# EAGLE design Modular-Sensor-Breakout-Board4 (EAGLE 5.12)

## Sheet 1 of 8
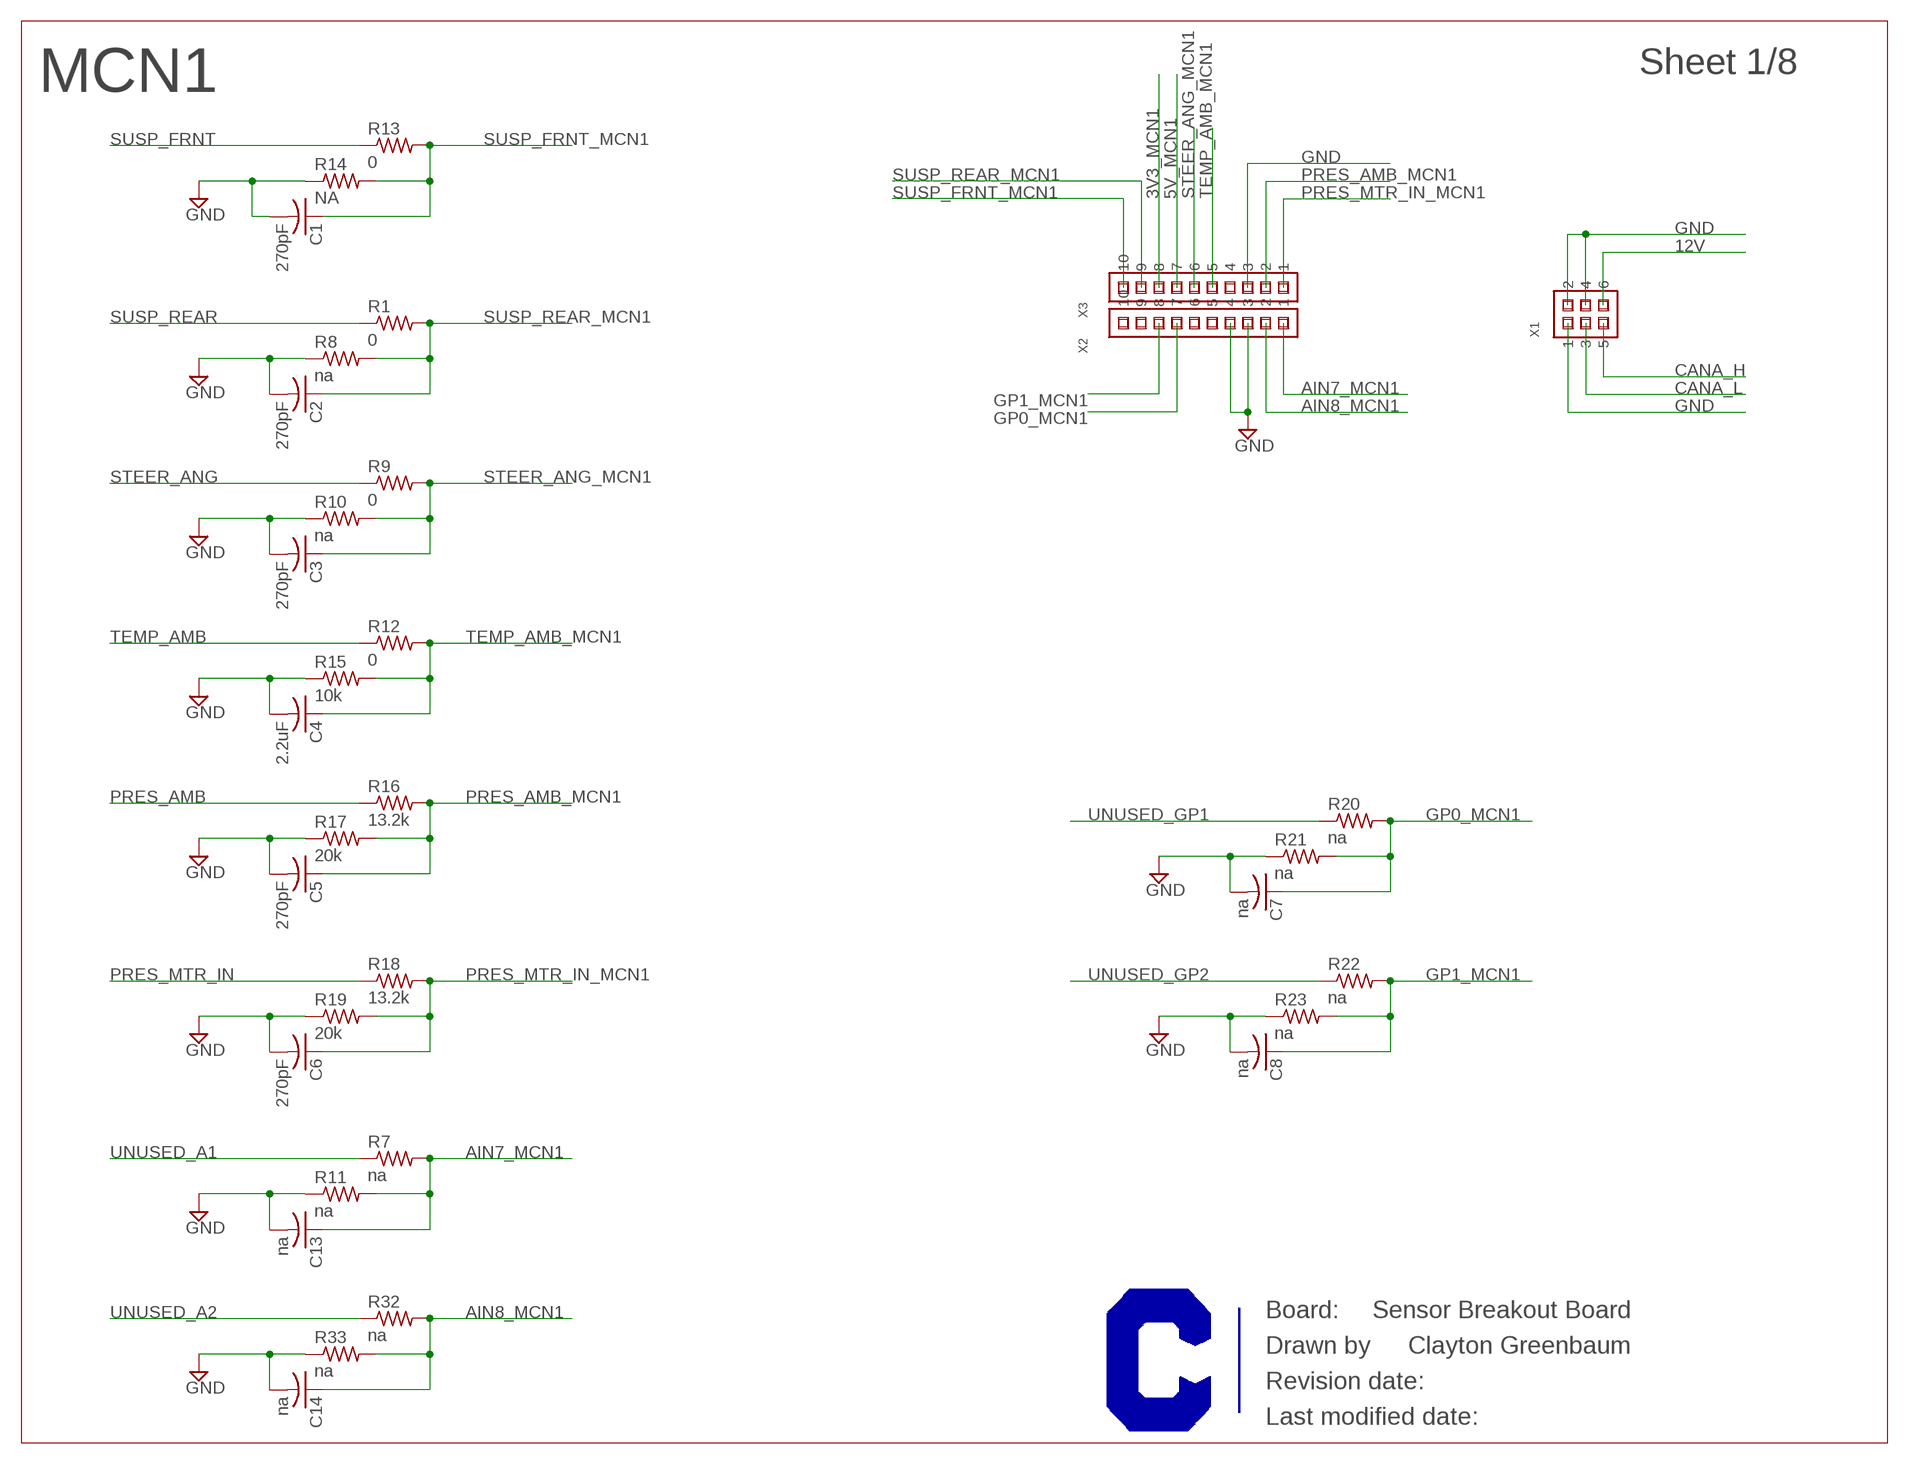
[diagram p0: schematic, sheet 1]

### Parts
C1  270pF  C-USC0603  [C0603]
C2  270pF  C-USC0603  [C0603]
C3  270pF  C-USC0603  [C0603]
C4  2.2uF  C-USC0603  [C0603]
C5  270pF  C-USC0603  [C0603]
C6  270pF  C-USC0603  [C0603]
C7  na  C-USC0603  [C0603]
C8  na  C-USC0603  [C0603]
C13  na  C-USC0603  [C0603]
C14  na  C-USC0603  [C0603]
R1  0  R-US_R0603  [R0603]
R7  na  R-US_R0603  [R0603]
R8  na  R-US_R0603  [R0603]
R9  0  R-US_R0603  [R0603]
R10  na  R-US_R0603  [R0603]
R11  na  R-US_R0603  [R0603]
R12  0  R-US_R0603  [R0603]
R13  0  R-US_R0603  [R0603]
R14  NA  R-US_R0603  [R0603]
R15  10k  R-US_R0603  [R0603]
R16  13.2k  R-US_R0603  [R0603]
R17  20k  R-US_R0603  [R0603]
R18  13.2k  R-US_R0603  [R0603]
R19  20k  R-US_R0603  [R0603]
R20  na  R-US_R0603  [R0603]
R21  na  R-US_R0603  [R0603]
R22  na  R-US_R0603  [R0603]
R23  na  R-US_R0603  [R0603]
R32  na  R-US_R0603  [R0603]
R33  na  R-US_R0603  [R0603]
X1  M22-71403XX  [M22-71403XX]
X2  M22-71310XX  [M22-71310XX]
X3  M22-71310XX  [M22-71310XX]

### Nets
3V3_MCN1 [Supply]: X3.8 ; also sheet 7
5V_MCN1 [Supply]: X3.7 ; also sheet 7
12V [Supply]: X1.6 ; also sheet 2,3,4,5,6,7,8
AIN7_MCN1: C13.1 R7.2 R11.2 X2.1
AIN8_MCN1: C14.1 R32.2 R33.2 X2.2
CANA_H: X1.5 ; also sheet 2,3,5,6,7
CANA_L: X1.3 ; also sheet 2,3,5,6,7
GND [Supply]: C1.2 C2.2 C3.2 C4.2 C5.2 C6.2 C7.2 C8.2 C13.2 C14.2 R8.1 R10.1 R11.1 R14.1 R15.1 R17.1 R19.1 R21.1 R23.1 R33.1 X1.1 X1.2 X1.4 X2.3 X2.4 X3.3 ; also sheet 2,3,4,5,6,7,8
GP0_MCN1: C7.1 R20.2 R21.2 X2.7
GP1_MCN1: C8.1 R22.2 R23.2 X2.8
PRES_AMB: R16.1 ; also sheet 7
PRES_AMB_MCN1: C5.1 R16.2 R17.2 X3.2
PRES_MTR_IN: R18.1 ; also sheet 7
PRES_MTR_IN_MCN1: C6.1 R18.2 R19.2 X3.1
STEER_ANG: R9.1 ; also sheet 7
STEER_ANG_MCN1: C3.1 R9.2 R10.2 X3.6
SUSP_FRNT: R13.1 ; also sheet 7
SUSP_FRNT_MCN1: C1.1 R13.2 R14.2 X3.10
SUSP_REAR: R1.1 ; also sheet 7
SUSP_REAR_MCN1: C2.1 R1.2 R8.2 X3.9
TEMP_AMB: R12.1 ; also sheet 7
TEMP_AMB_MCN1: C4.1 R12.2 R15.2 X3.5
UNUSED_A1: R7.1 ; also sheet 7
UNUSED_A2: R32.1 ; also sheet 7
UNUSED_GP1: R20.1 ; also sheet 7
UNUSED_GP2: R22.1 ; also sheet 7
Unconnected: X2.5 X2.6 X2.9 X2.10 X3.4

### Notes on the sheet
- MCN1
- Sensor Breakout Board
- Clayton Greenbaum

## Sheet 2 of 8
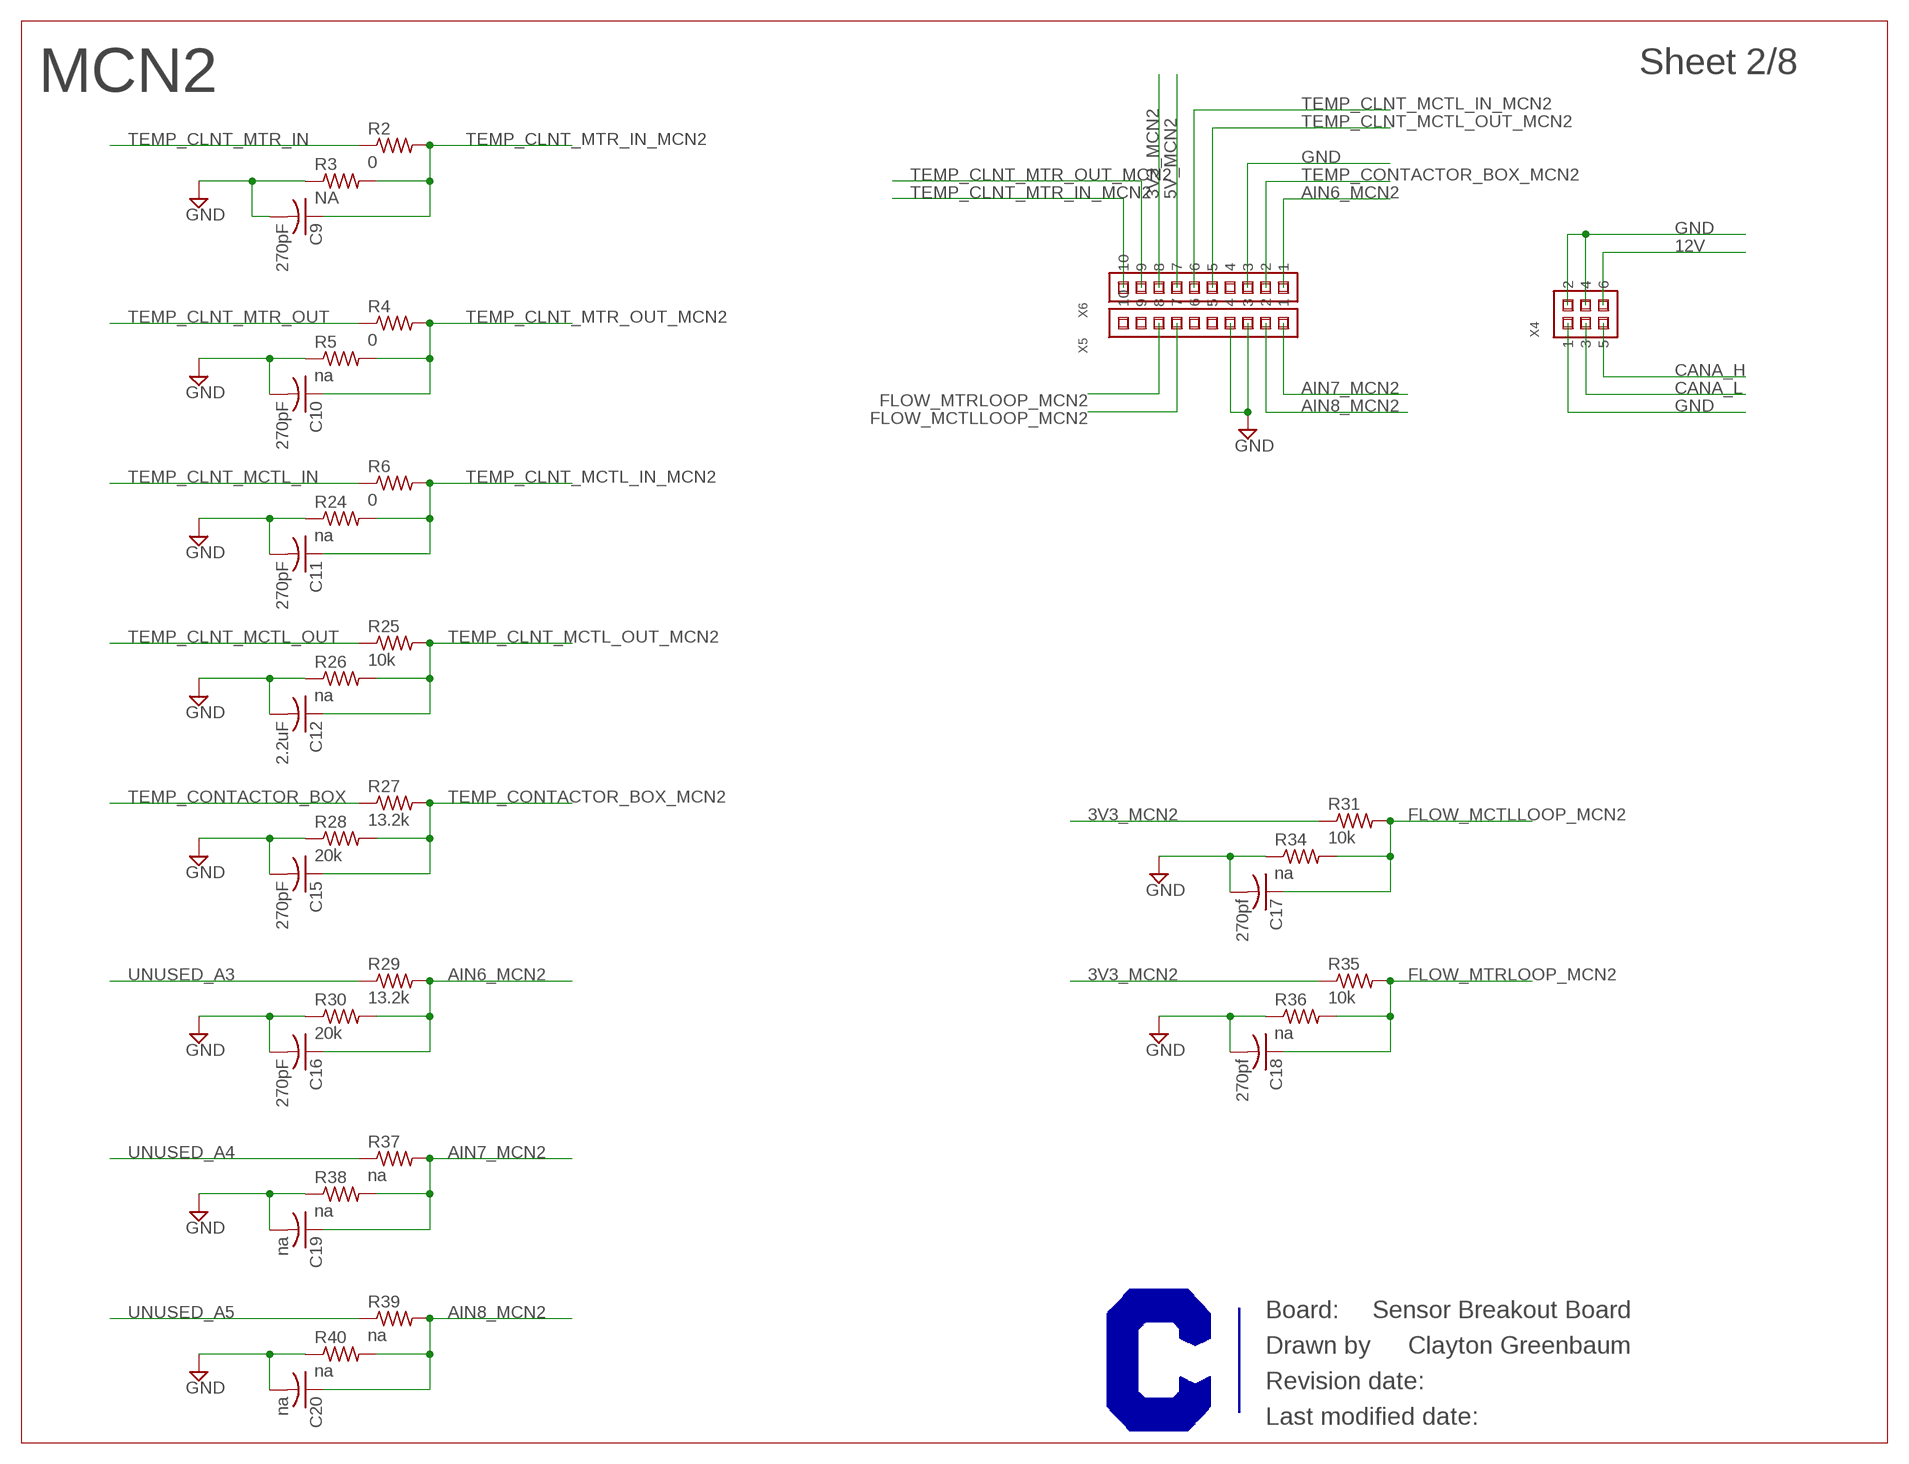
[diagram p1: schematic, sheet 2]

### Parts
C9  270pF  C-USC0603  [C0603]
C10  270pF  C-USC0603  [C0603]
C11  270pF  C-USC0603  [C0603]
C12  2.2uF  C-USC0603  [C0603]
C15  270pF  C-USC0603  [C0603]
C16  270pF  C-USC0603  [C0603]
C17  270pf  C-USC0603  [C0603]
C18  270pf  C-USC0603  [C0603]
C19  na  C-USC0603  [C0603]
C20  na  C-USC0603  [C0603]
R2  0  R-US_R0603  [R0603]
R3  NA  R-US_R0603  [R0603]
R4  0  R-US_R0603  [R0603]
R5  na  R-US_R0603  [R0603]
R6  0  R-US_R0603  [R0603]
R24  na  R-US_R0603  [R0603]
R25  10k  R-US_R0603  [R0603]
R26  na  R-US_R0603  [R0603]
R27  13.2k  R-US_R0603  [R0603]
R28  20k  R-US_R0603  [R0603]
R29  13.2k  R-US_R0603  [R0603]
R30  20k  R-US_R0603  [R0603]
R31  10k  R-US_R0603  [R0603]
R34  na  R-US_R0603  [R0603]
R35  10k  R-US_R0603  [R0603]
R36  na  R-US_R0603  [R0603]
R37  na  R-US_R0603  [R0603]
R38  na  R-US_R0603  [R0603]
R39  na  R-US_R0603  [R0603]
R40  na  R-US_R0603  [R0603]
X4  M22-71403XX  [M22-71403XX]
X5  M22-71310XX  [M22-71310XX]
X6  M22-71310XX  [M22-71310XX]

### Nets
3V3_MCN2 [Supply]: R31.1 R35.1 X6.8 ; also sheet 7
5V_MCN2 [Supply]: X6.7 ; also sheet 7
12V [Supply]: X4.6 ; also sheet 1,3,4,5,6,7,8
AIN6_MCN2: C16.1 R29.2 R30.2 X6.1
AIN7_MCN2: C19.1 R37.2 R38.2 X5.1
AIN8_MCN2: C20.1 R39.2 R40.2 X5.2
CANA_H: X4.5 ; also sheet 1,3,5,6,7
CANA_L: X4.3 ; also sheet 1,3,5,6,7
FLOW_MCTLLOOP_MCN2: C17.1 R31.2 R34.2 X5.7 ; also sheet 7
FLOW_MTRLOOP_MCN2: C18.1 R35.2 R36.2 X5.8 ; also sheet 7
GND [Supply]: C9.2 C10.2 C11.2 C12.2 C15.2 C16.2 C17.2 C18.2 C19.2 C20.2 R3.1 R5.1 R24.1 R26.1 R28.1 R30.1 R34.1 R36.1 R38.1 R40.1 X4.1 X4.2 X4.4 X5.3 X5.4 X6.3 ; also sheet 1,3,4,5,6,7,8
TEMP_CLNT_MCTL_IN: R6.1 ; also sheet 7
TEMP_CLNT_MCTL_IN_MCN2: C11.1 R6.2 R24.2 X6.6
TEMP_CLNT_MCTL_OUT: R25.1 ; also sheet 7
TEMP_CLNT_MCTL_OUT_MCN2: C12.1 R25.2 R26.2 X6.5
TEMP_CLNT_MTR_IN: R2.1 ; also sheet 7
TEMP_CLNT_MTR_IN_MCN2: C9.1 R2.2 R3.2 X6.10
TEMP_CLNT_MTR_OUT: R4.1 ; also sheet 7
TEMP_CLNT_MTR_OUT_MCN2: C10.1 R4.2 R5.2 X6.9
TEMP_CONTACTOR_BOX: R27.1 ; also sheet 7
TEMP_CONTACTOR_BOX_MCN2: C15.1 R27.2 R28.2 X6.2
UNUSED_A3: R29.1 ; also sheet 7
UNUSED_A4: R37.1 ; also sheet 7
UNUSED_A5: R39.1 ; also sheet 7
Unconnected: X5.5 X5.6 X5.9 X5.10 X6.4

### Notes on the sheet
- MCN2
- Sensor Breakout Board
- Clayton Greenbaum

## Sheet 3 of 8
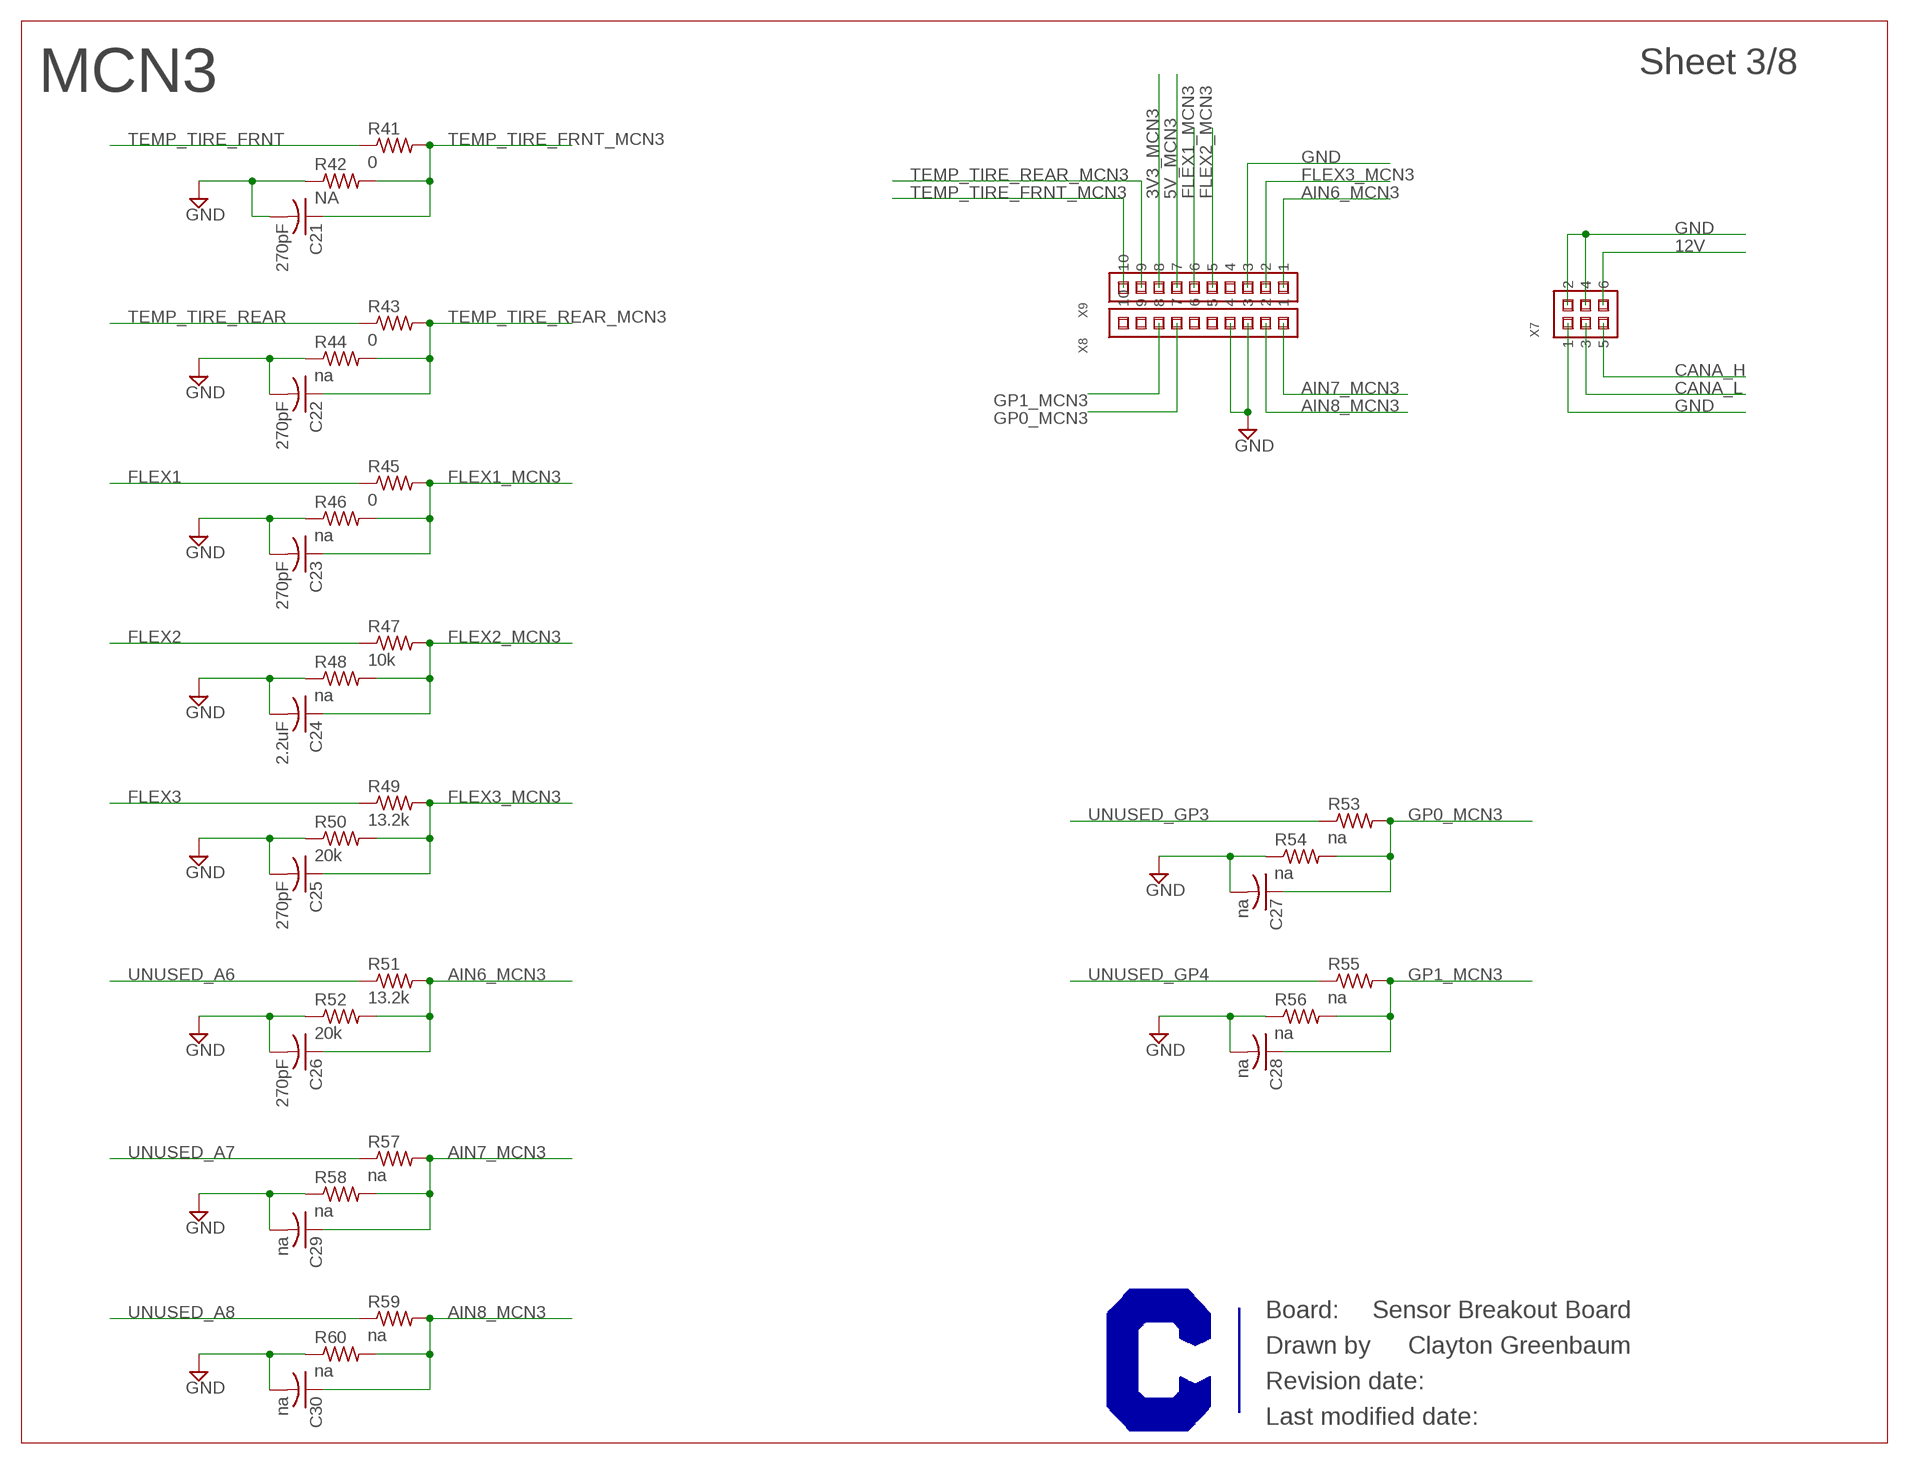
[diagram p2: schematic, sheet 3]

### Parts
C21  270pF  C-USC0603  [C0603]
C22  270pF  C-USC0603  [C0603]
C23  270pF  C-USC0603  [C0603]
C24  2.2uF  C-USC0603  [C0603]
C25  270pF  C-USC0603  [C0603]
C26  270pF  C-USC0603  [C0603]
C27  na  C-USC0603  [C0603]
C28  na  C-USC0603  [C0603]
C29  na  C-USC0603  [C0603]
C30  na  C-USC0603  [C0603]
R41  0  R-US_R0603  [R0603]
R42  NA  R-US_R0603  [R0603]
R43  0  R-US_R0603  [R0603]
R44  na  R-US_R0603  [R0603]
R45  0  R-US_R0603  [R0603]
R46  na  R-US_R0603  [R0603]
R47  10k  R-US_R0603  [R0603]
R48  na  R-US_R0603  [R0603]
R49  13.2k  R-US_R0603  [R0603]
R50  20k  R-US_R0603  [R0603]
R51  13.2k  R-US_R0603  [R0603]
R52  20k  R-US_R0603  [R0603]
R53  na  R-US_R0603  [R0603]
R54  na  R-US_R0603  [R0603]
R55  na  R-US_R0603  [R0603]
R56  na  R-US_R0603  [R0603]
R57  na  R-US_R0603  [R0603]
R58  na  R-US_R0603  [R0603]
R59  na  R-US_R0603  [R0603]
R60  na  R-US_R0603  [R0603]
X7  M22-71403XX  [M22-71403XX]
X8  M22-71310XX  [M22-71310XX]
X9  M22-71310XX  [M22-71310XX]

### Nets
3V3_MCN3 [Supply]: X9.8 ; also sheet 7
5V_MCN3 [Supply]: X9.7 ; also sheet 7
12V [Supply]: X7.6 ; also sheet 1,2,4,5,6,7,8
AIN6_MCN3: C26.1 R51.2 R52.2 X9.1
AIN7_MCN3: C29.1 R57.2 R58.2 X8.1
AIN8_MCN3: C30.1 R59.2 R60.2 X8.2
CANA_H: X7.5 ; also sheet 1,2,5,6,7
CANA_L: X7.3 ; also sheet 1,2,5,6,7
FLEX1: R45.1 ; also sheet 7
FLEX1_MCN3: C23.1 R45.2 R46.2 X9.6
FLEX2: R47.1 ; also sheet 7
FLEX2_MCN3: C24.1 R47.2 R48.2 X9.5
FLEX3: R49.1 ; also sheet 7
FLEX3_MCN3: C25.1 R49.2 R50.2 X9.2
GND [Supply]: C21.2 C22.2 C23.2 C24.2 C25.2 C26.2 C27.2 C28.2 C29.2 C30.2 R42.1 R44.1 R46.1 R48.1 R50.1 R52.1 R54.1 R56.1 R58.1 R60.1 X7.1 X7.2 X7.4 X8.3 X8.4 X9.3 ; also sheet 1,2,4,5,6,7,8
GP0_MCN3: C27.1 R53.2 R54.2 X8.7
GP1_MCN3: C28.1 R55.2 R56.2 X8.8
TEMP_TIRE_FRNT: R41.1 ; also sheet 7
TEMP_TIRE_FRNT_MCN3: C21.1 R41.2 R42.2 X9.10
TEMP_TIRE_REAR: R43.1 ; also sheet 7
TEMP_TIRE_REAR_MCN3: C22.1 R43.2 R44.2 X9.9
UNUSED_A6: R51.1 ; also sheet 7
UNUSED_A7: R57.1 ; also sheet 7
UNUSED_A8: R59.1 ; also sheet 7
UNUSED_GP3: R53.1 ; also sheet 7
UNUSED_GP4: R55.1 ; also sheet 7
Unconnected: X8.5 X8.6 X8.9 X8.10 X9.4

### Notes on the sheet
- MCN3
- Sensor Breakout Board
- Clayton Greenbaum

## Sheet 4 of 8
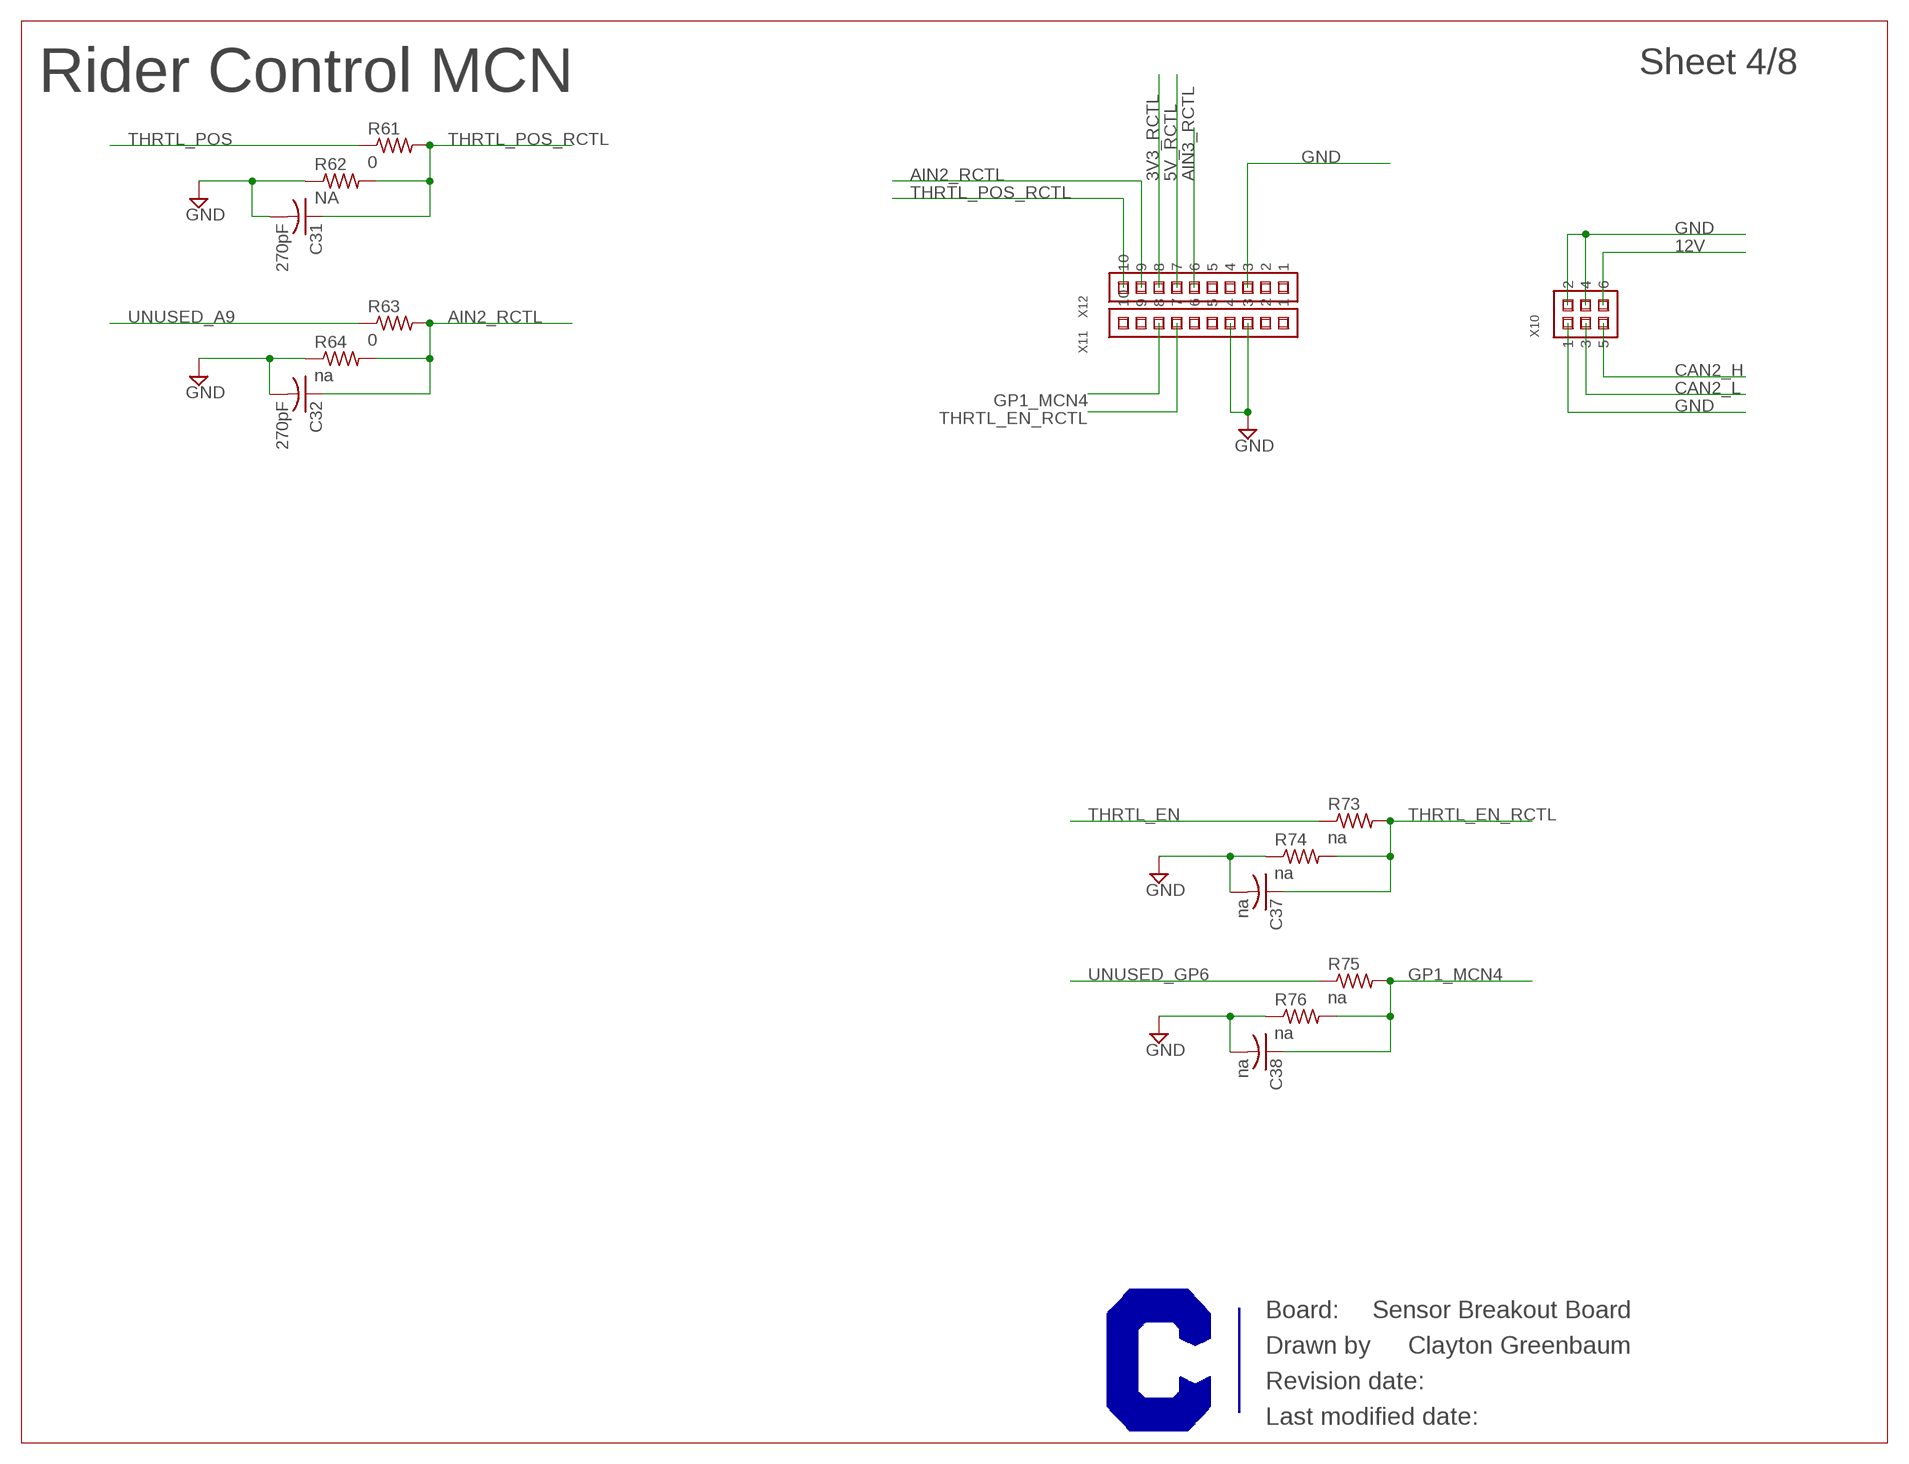
[diagram p3: schematic, sheet 4]

### Parts
C31  270pF  C-USC0603  [C0603]
C32  270pF  C-USC0603  [C0603]
C37  na  C-USC0603  [C0603]
C38  na  C-USC0603  [C0603]
R61  0  R-US_R0603  [R0603]
R62  NA  R-US_R0603  [R0603]
R63  0  R-US_R0603  [R0603]
R64  na  R-US_R0603  [R0603]
R73  na  R-US_R0603  [R0603]
R74  na  R-US_R0603  [R0603]
R75  na  R-US_R0603  [R0603]
R76  na  R-US_R0603  [R0603]
X10  M22-71403XX  [M22-71403XX]
X11  M22-71310XX  [M22-71310XX]
X12  M22-71310XX  [M22-71310XX]

### Nets
3V3_RCTL [Supply]: X12.8 ; also sheet 7
5V_RCTL [Supply]: X12.7 ; also sheet 7
12V [Supply]: X10.6 ; also sheet 1,2,3,5,6,7,8
AIN2_RCTL: C32.1 R63.2 R64.2 X12.9
AIN3_RCTL: X12.6
CAN2_H: X10.5 ; also sheet 6,7
CAN2_L: X10.3 ; also sheet 6,7
GND [Supply]: C31.2 C32.2 C37.2 C38.2 R62.1 R64.1 R74.1 R76.1 X10.1 X10.2 X10.4 X11.3 X11.4 X12.3 ; also sheet 1,2,3,5,6,7,8
GP1_MCN4: C38.1 R75.2 R76.2 X11.8
THRTL_EN: R73.1 ; also sheet 7
THRTL_EN_RCTL: C37.1 R73.2 R74.2 X11.7
THRTL_POS: R61.1 ; also sheet 7
THRTL_POS_RCTL: C31.1 R61.2 R62.2 X12.10
UNUSED_A9: R63.1 ; also sheet 7
UNUSED_GP6: R75.1 ; also sheet 7
Unconnected: X11.1 X11.2 X11.5 X11.6 X11.9 X11.10 X12.1 X12.2 X12.4 X12.5

### Notes on the sheet
- Rider Control MCN
- Sensor Breakout Board
- Clayton Greenbaum

## Sheet 5 of 8
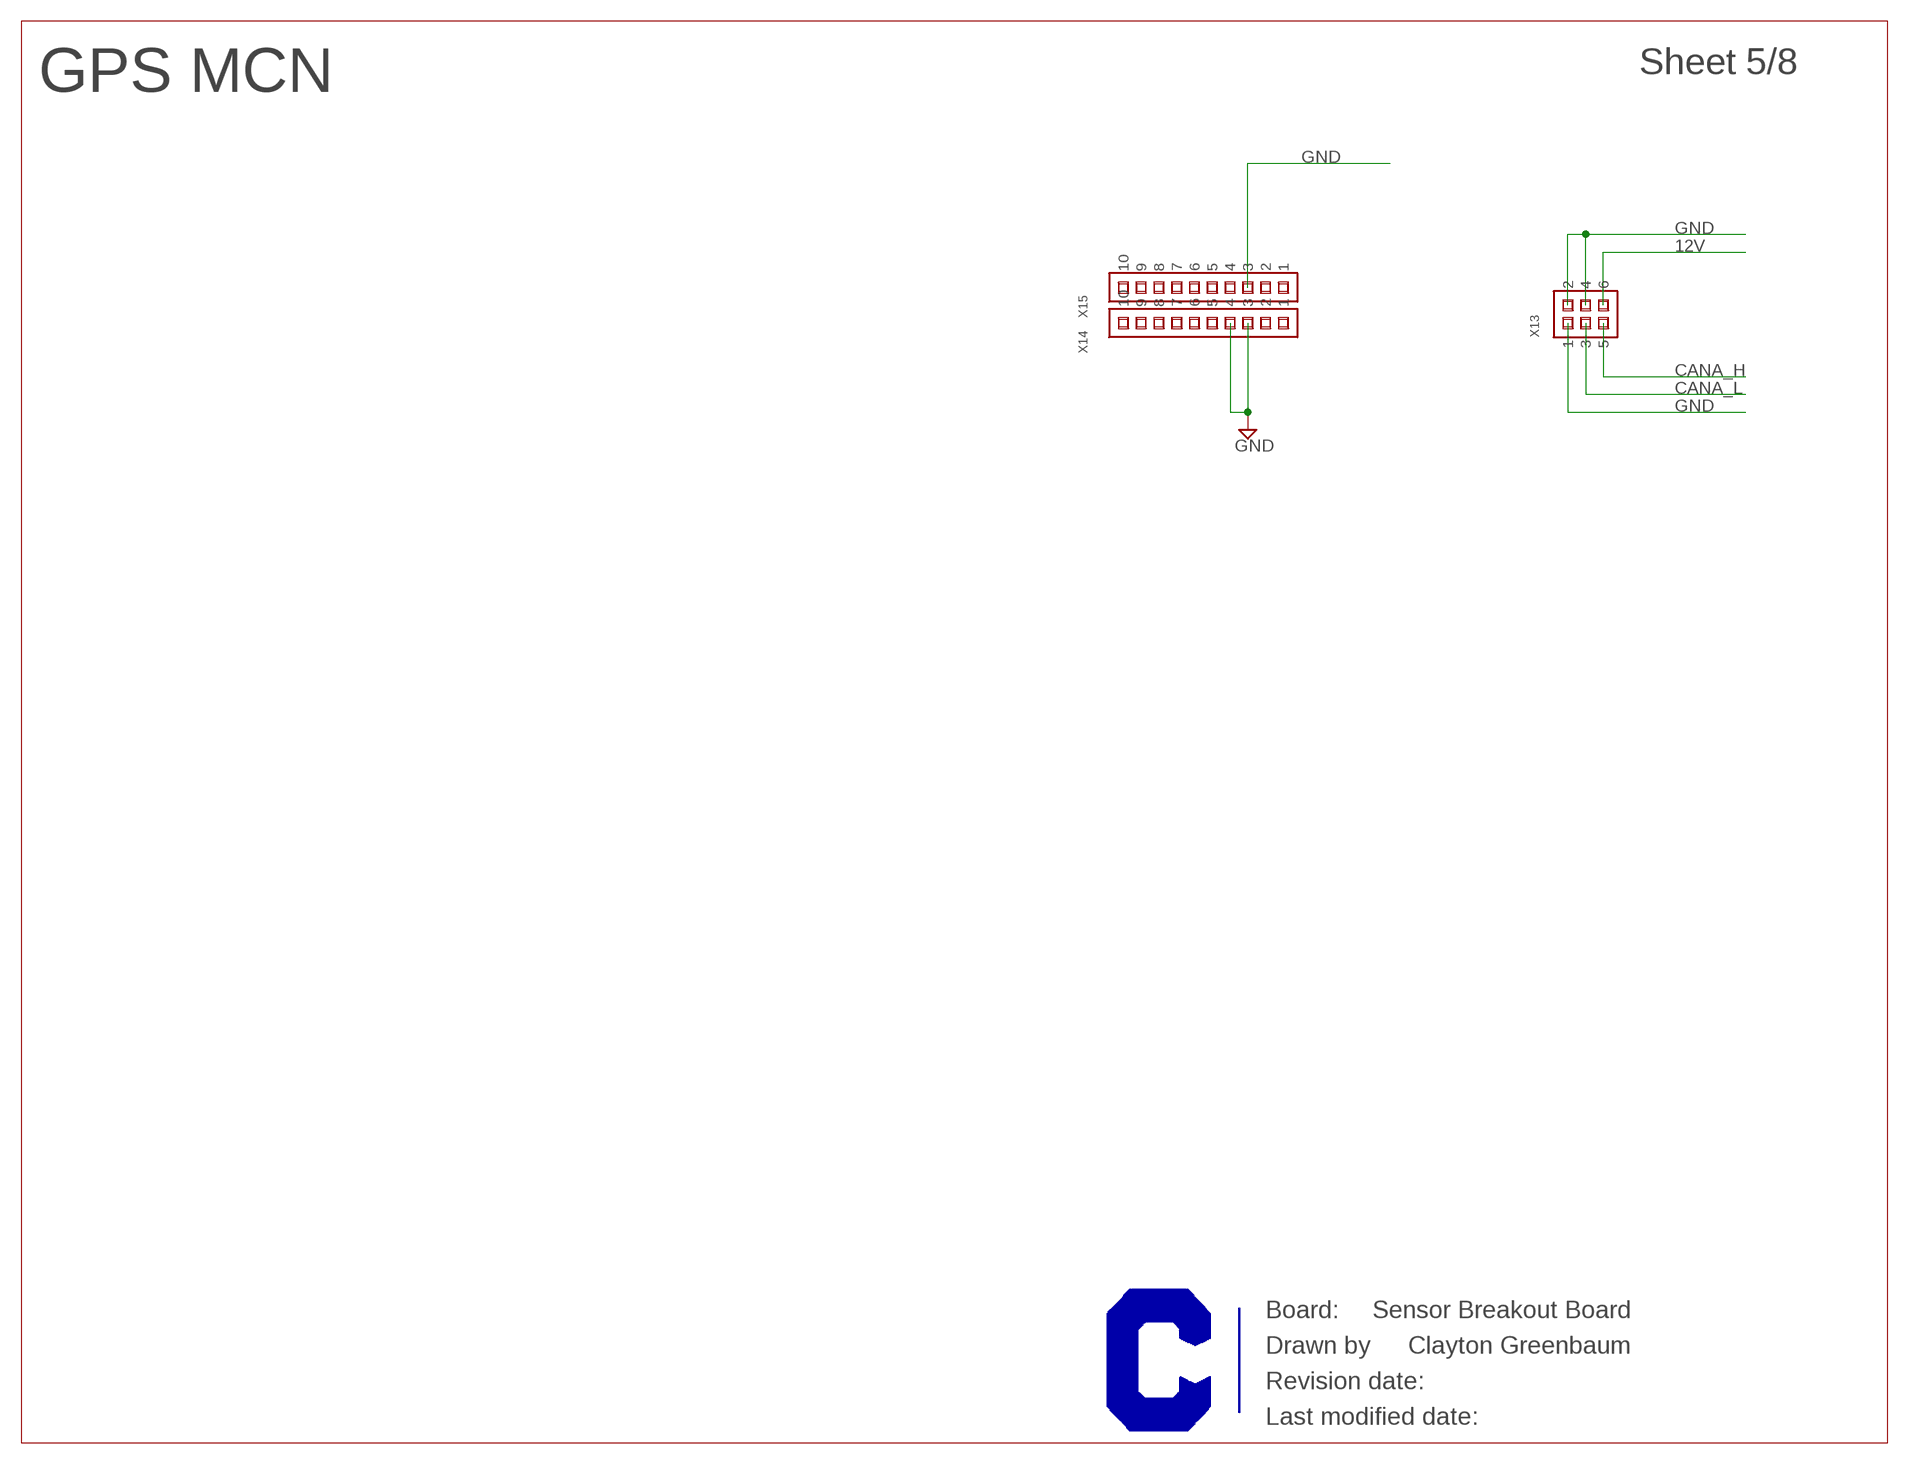
[diagram p4: schematic, sheet 5]

### Parts
X13  M22-71403XX  [M22-71403XX]
X14  M22-71310XX  [M22-71310XX]
X15  M22-71310XX  [M22-71310XX]

### Nets
12V [Supply]: X13.6 ; also sheet 1,2,3,4,6,7,8
CANA_H: X13.5 ; also sheet 1,2,3,6,7
CANA_L: X13.3 ; also sheet 1,2,3,6,7
GND [Supply]: X13.1 X13.2 X13.4 X14.3 X14.4 X15.3 ; also sheet 1,2,3,4,6,7,8
Unconnected: X14.1 X14.2 X14.5 X14.6 X14.7 X14.8 X14.9 X14.10 X15.1 X15.2 X15.4 X15.5 X15.6 X15.7 X15.8 X15.9 X15.10

### Notes on the sheet
- GPS MCN
- Sensor Breakout Board
- Clayton Greenbaum

## Sheet 6 of 8
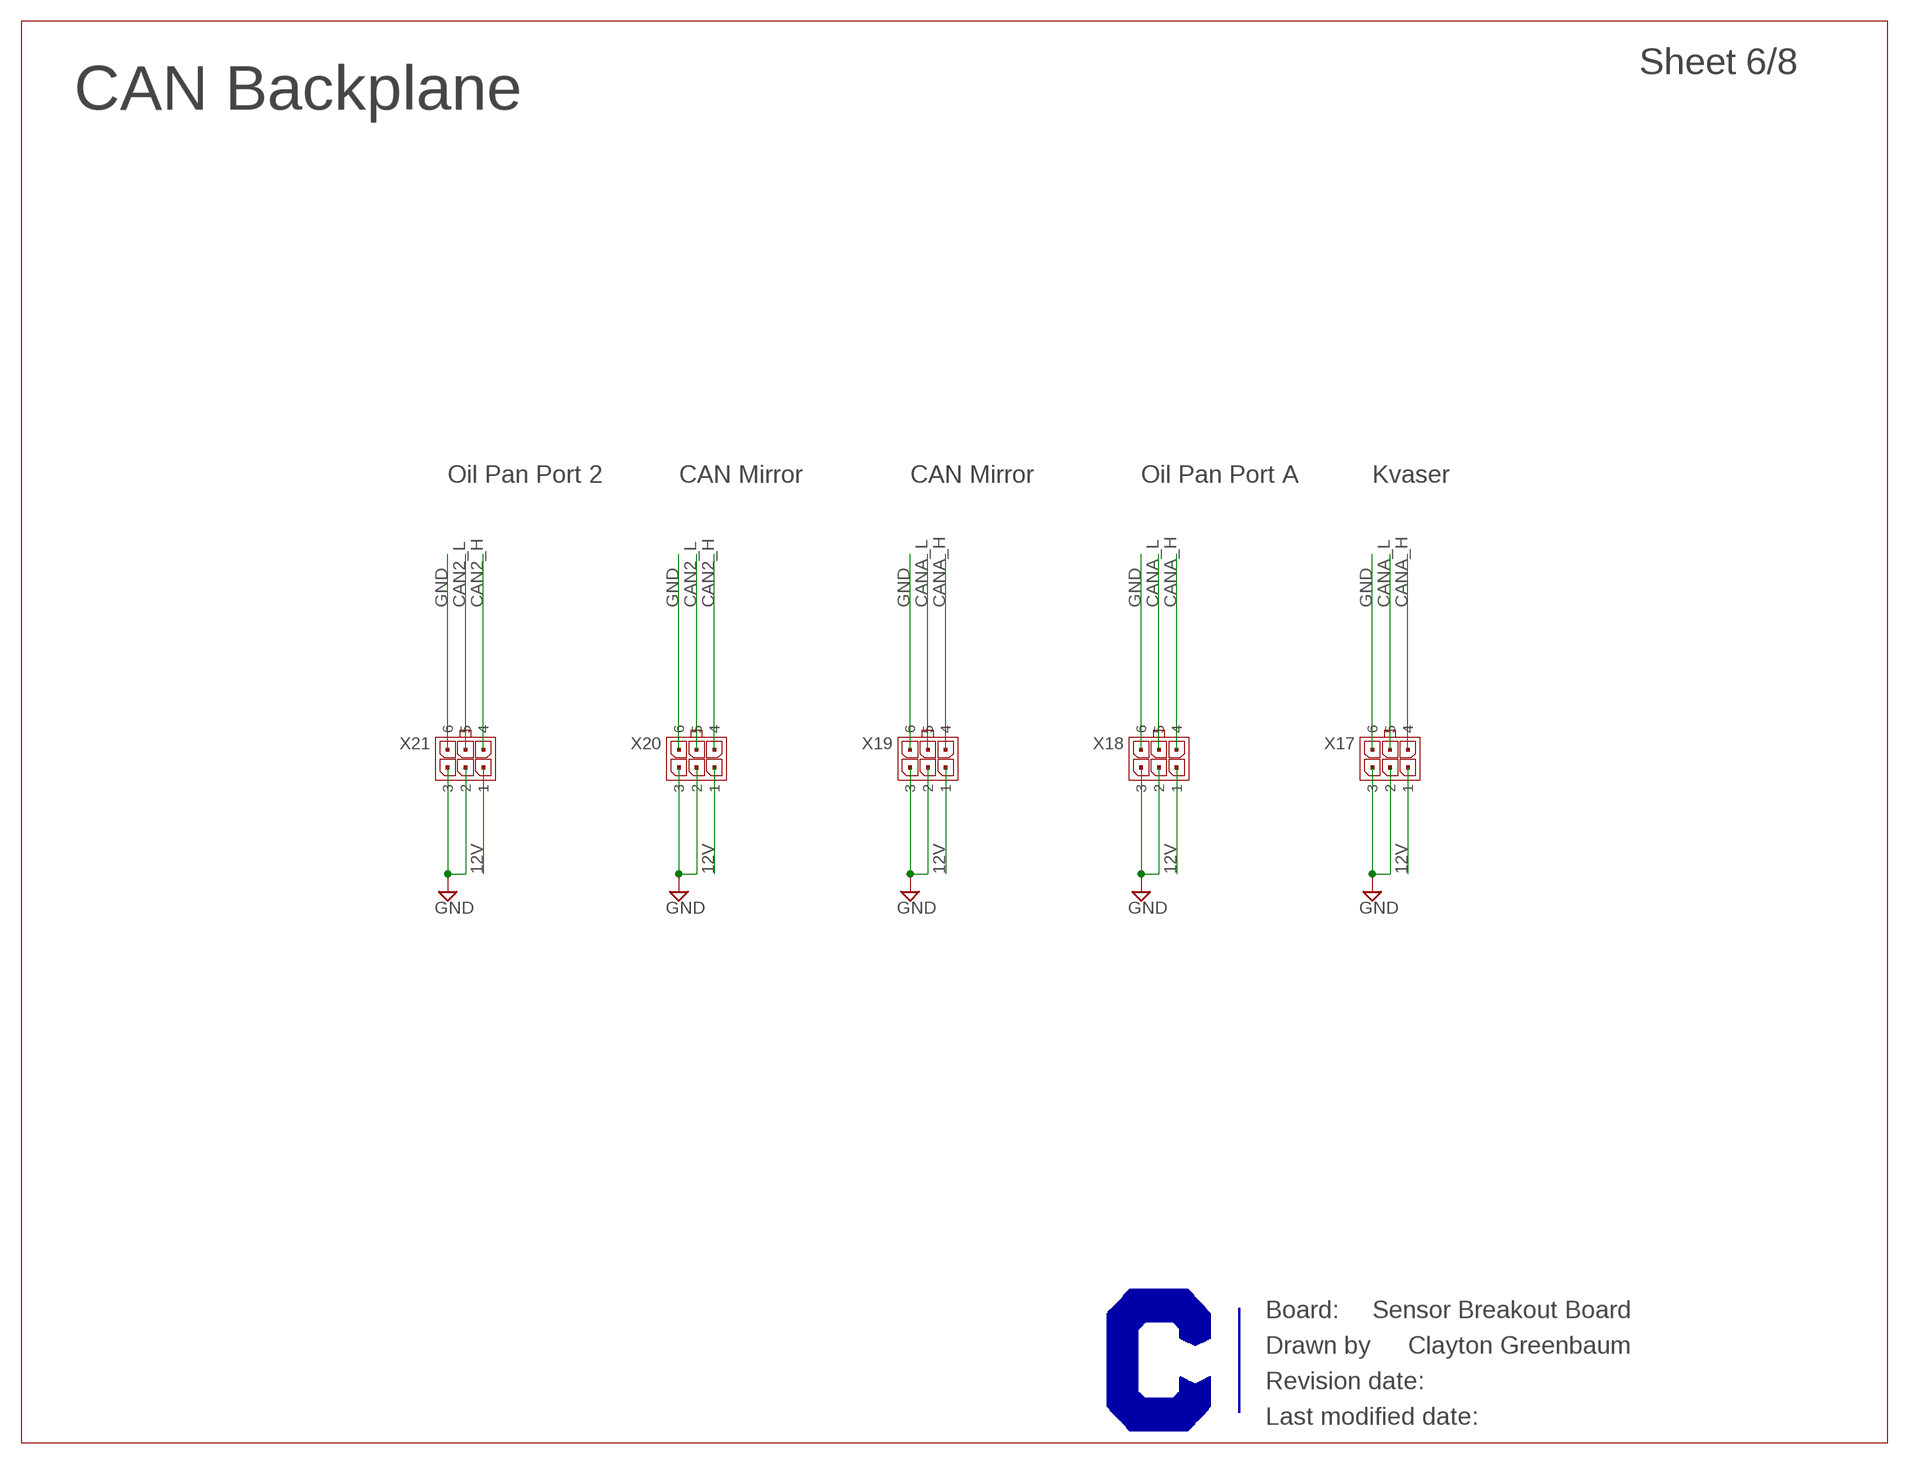
[diagram p5: schematic, sheet 6]

### Parts
X17  MICROFIT-06-DUAL-THROUGH_HOLE-PEG_RETENTION-GOLD  [MICROFIT-6-DUAL-RA-THROUGH_HOLE-PEG_RETENTION]
X18  MICROFIT-06-DUAL-THROUGH_HOLE-PEG_RETENTION-GOLD  [MICROFIT-6-DUAL-RA-THROUGH_HOLE-PEG_RETENTION]
X19  MICROFIT-06-DUAL-THROUGH_HOLE-PEG_RETENTION-GOLD  [MICROFIT-6-DUAL-RA-THROUGH_HOLE-PEG_RETENTION]
X20  MICROFIT-06-DUAL-THROUGH_HOLE-PEG_RETENTION-GOLD  [MICROFIT-6-DUAL-RA-THROUGH_HOLE-PEG_RETENTION]
X21  MICROFIT-06-DUAL-THROUGH_HOLE-PEG_RETENTION-GOLD  [MICROFIT-6-DUAL-RA-THROUGH_HOLE-PEG_RETENTION]

### Nets
12V [Supply]: X17.1 X18.1 X19.1 X20.1 X21.1 ; also sheet 1,2,3,4,5,7,8
CAN2_H: X20.4 X21.4 ; also sheet 4,7
CAN2_L: X20.5 X21.5 ; also sheet 4,7
CANA_H: X17.4 X18.4 X19.4 ; also sheet 1,2,3,5,7
CANA_L: X17.5 X18.5 X19.5 ; also sheet 1,2,3,5,7
GND [Supply]: X17.2 X17.3 X17.6 X18.2 X18.3 X18.6 X19.2 X19.3 X19.6 X20.2 X20.3 X20.6 X21.2 X21.3 X21.6 ; also sheet 1,2,3,4,5,7,8

### Notes on the sheet
- CAN Backplane
- Oil Pan Port 2 | CAN Mirror | CAN Mirror | Oil Pan Port A | Kvaser
- Sensor Breakout Board
- Clayton Greenbaum

## Sheet 7 of 8
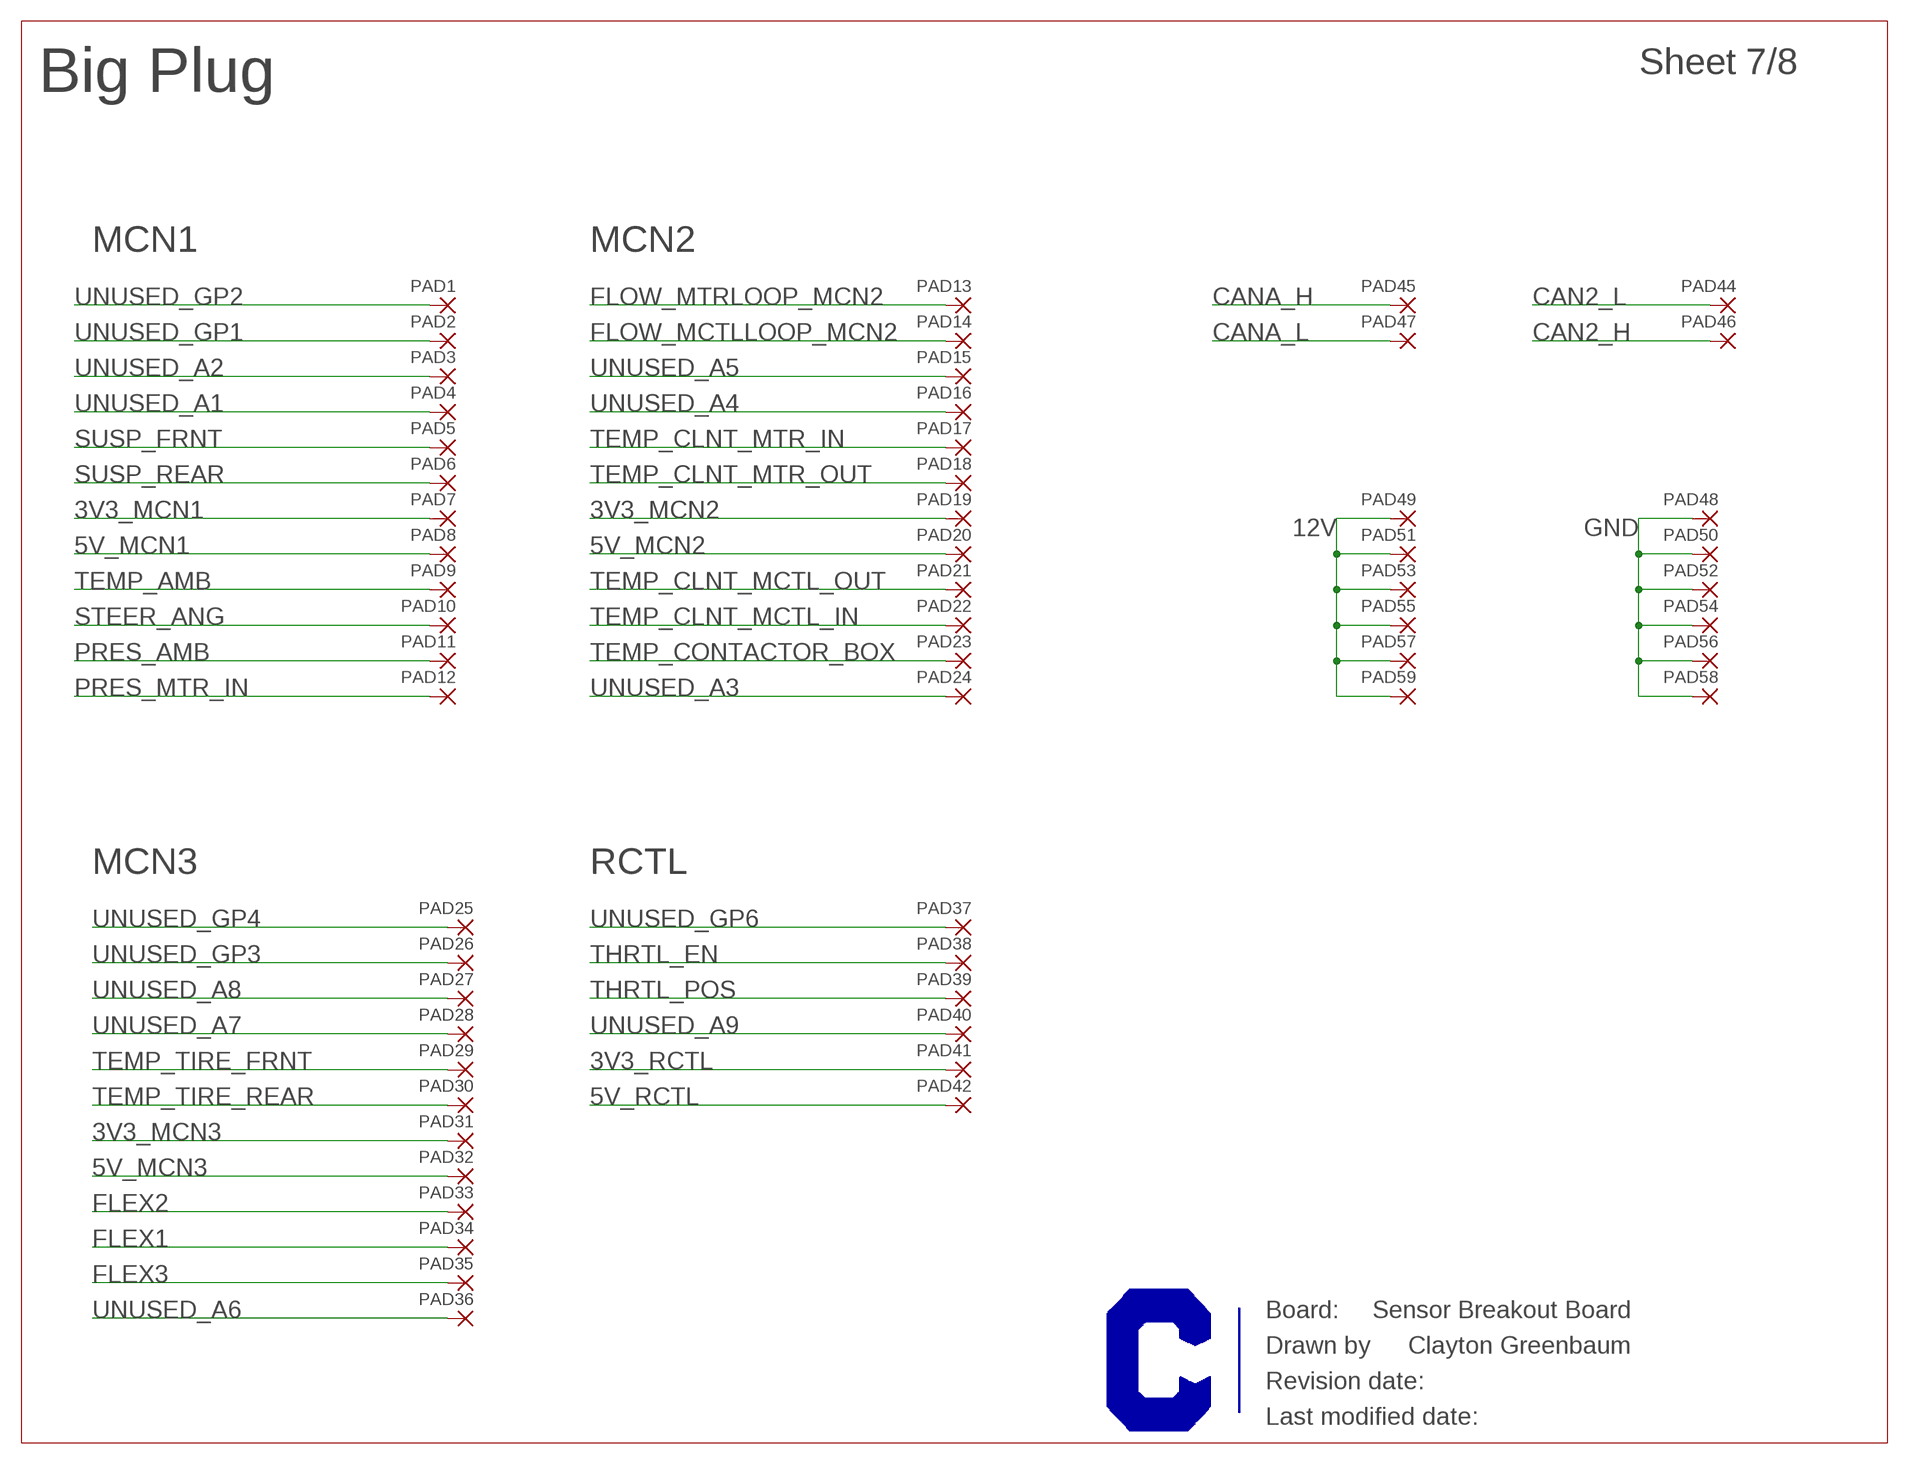
[diagram p6: schematic, sheet 7]

### Parts
PAD1  2,54/0,9  [2,54/0,9]
PAD2  2,54/0,9  [2,54/0,9]
PAD3  2,54/0,9  [2,54/0,9]
PAD4  2,54/0,9  [2,54/0,9]
PAD5  2,54/0,9  [2,54/0,9]
PAD6  2,54/0,9  [2,54/0,9]
PAD7  2,54/0,9  [2,54/0,9]
PAD8  2,54/0,9  [2,54/0,9]
PAD9  2,54/0,9  [2,54/0,9]
PAD10  2,54/0,9  [2,54/0,9]
PAD11  2,54/0,9  [2,54/0,9]
PAD12  2,54/0,9  [2,54/0,9]
PAD13  2,54/0,9  [2,54/0,9]
PAD14  2,54/0,9  [2,54/0,9]
PAD15  2,54/0,9  [2,54/0,9]
PAD16  2,54/0,9  [2,54/0,9]
PAD17  2,54/0,9  [2,54/0,9]
PAD18  2,54/0,9  [2,54/0,9]
PAD19  2,54/0,9  [2,54/0,9]
PAD20  2,54/0,9  [2,54/0,9]
PAD21  2,54/0,9  [2,54/0,9]
PAD22  2,54/0,9  [2,54/0,9]
PAD23  2,54/0,9  [2,54/0,9]
PAD24  2,54/0,9  [2,54/0,9]
PAD25  2,54/0,9  [2,54/0,9]
PAD26  2,54/0,9  [2,54/0,9]
PAD27  2,54/0,9  [2,54/0,9]
PAD28  2,54/0,9  [2,54/0,9]
PAD29  2,54/0,9  [2,54/0,9]
PAD30  2,54/0,9  [2,54/0,9]
PAD31  2,54/0,9  [2,54/0,9]
PAD32  2,54/0,9  [2,54/0,9]
PAD33  2,54/0,9  [2,54/0,9]
PAD34  2,54/0,9  [2,54/0,9]
PAD35  2,54/0,9  [2,54/0,9]
PAD36  2,54/0,9  [2,54/0,9]
PAD37  2,54/0,9  [2,54/0,9]
PAD38  2,54/0,9  [2,54/0,9]
PAD39  2,54/0,9  [2,54/0,9]
PAD40  2,54/0,9  [2,54/0,9]
PAD41  2,54/0,9  [2,54/0,9]
PAD42  2,54/0,9  [2,54/0,9]
PAD44  2,54/0,9  [2,54/0,9]
PAD45  2,54/0,9  [2,54/0,9]
PAD46  2,54/0,9  [2,54/0,9]
PAD47  2,54/0,9  [2,54/0,9]
PAD48  2,54/0,9  [2,54/0,9]
PAD49  2,54/0,9  [2,54/0,9]
PAD50  2,54/0,9  [2,54/0,9]
PAD51  2,54/0,9  [2,54/0,9]
PAD52  2,54/0,9  [2,54/0,9]
PAD53  2,54/0,9  [2,54/0,9]
PAD54  2,54/0,9  [2,54/0,9]
PAD55  2,54/0,9  [2,54/0,9]
PAD56  2,54/0,9  [2,54/0,9]
PAD57  2,54/0,9  [2,54/0,9]
PAD58  2,54/0,9  [2,54/0,9]
PAD59  2,54/0,9  [2,54/0,9]

### Nets
3V3_MCN1 [Supply]: PAD7.1(P) ; also sheet 1
3V3_MCN2 [Supply]: PAD19.1(P) ; also sheet 2
3V3_MCN3 [Supply]: PAD31.1(P) ; also sheet 3
3V3_RCTL [Supply]: PAD41.1(P) ; also sheet 4
5V_MCN1 [Supply]: PAD8.1(P) ; also sheet 1
5V_MCN2 [Supply]: PAD20.1(P) ; also sheet 2
5V_MCN3 [Supply]: PAD32.1(P) ; also sheet 3
5V_RCTL [Supply]: PAD42.1(P) ; also sheet 4
12V [Supply]: PAD49.1(P) PAD51.1(P) PAD53.1(P) PAD55.1(P) PAD57.1(P) PAD59.1(P) ; also sheet 1,2,3,4,5,6,8
CAN2_H: PAD46.1(P) ; also sheet 4,6
CAN2_L: PAD44.1(P) ; also sheet 4,6
CANA_H: PAD45.1(P) ; also sheet 1,2,3,5,6
CANA_L: PAD47.1(P) ; also sheet 1,2,3,5,6
FLEX1: PAD34.1(P) ; also sheet 3
FLEX2: PAD33.1(P) ; also sheet 3
FLEX3: PAD35.1(P) ; also sheet 3
FLOW_MCTLLOOP_MCN2: PAD14.1(P) ; also sheet 2
FLOW_MTRLOOP_MCN2: PAD13.1(P) ; also sheet 2
GND [Supply]: PAD48.1(P) PAD50.1(P) PAD52.1(P) PAD54.1(P) PAD56.1(P) PAD58.1(P) ; also sheet 1,2,3,4,5,6,8
PRES_AMB: PAD11.1(P) ; also sheet 1
PRES_MTR_IN: PAD12.1(P) ; also sheet 1
STEER_ANG: PAD10.1(P) ; also sheet 1
SUSP_FRNT: PAD5.1(P) ; also sheet 1
SUSP_REAR: PAD6.1(P) ; also sheet 1
TEMP_AMB: PAD9.1(P) ; also sheet 1
TEMP_CLNT_MCTL_IN: PAD22.1(P) ; also sheet 2
TEMP_CLNT_MCTL_OUT: PAD21.1(P) ; also sheet 2
TEMP_CLNT_MTR_IN: PAD17.1(P) ; also sheet 2
TEMP_CLNT_MTR_OUT: PAD18.1(P) ; also sheet 2
TEMP_CONTACTOR_BOX: PAD23.1(P) ; also sheet 2
TEMP_TIRE_FRNT: PAD29.1(P) ; also sheet 3
TEMP_TIRE_REAR: PAD30.1(P) ; also sheet 3
THRTL_EN: PAD38.1(P) ; also sheet 4
THRTL_POS: PAD39.1(P) ; also sheet 4
UNUSED_A1: PAD4.1(P) ; also sheet 1
UNUSED_A2: PAD3.1(P) ; also sheet 1
UNUSED_A3: PAD24.1(P) ; also sheet 2
UNUSED_A4: PAD16.1(P) ; also sheet 2
UNUSED_A5: PAD15.1(P) ; also sheet 2
UNUSED_A6: PAD36.1(P) ; also sheet 3
UNUSED_A7: PAD28.1(P) ; also sheet 3
UNUSED_A8: PAD27.1(P) ; also sheet 3
UNUSED_A9: PAD40.1(P) ; also sheet 4
UNUSED_GP1: PAD2.1(P) ; also sheet 1
UNUSED_GP2: PAD1.1(P) ; also sheet 1
UNUSED_GP3: PAD26.1(P) ; also sheet 3
UNUSED_GP4: PAD25.1(P) ; also sheet 3
UNUSED_GP6: PAD37.1(P) ; also sheet 4

### Notes on the sheet
- Big Plug
- MCN1 | MCN2
- MCN3 | RCTL
- Sensor Breakout Board
- Clayton Greenbaum

## Sheet 8 of 8
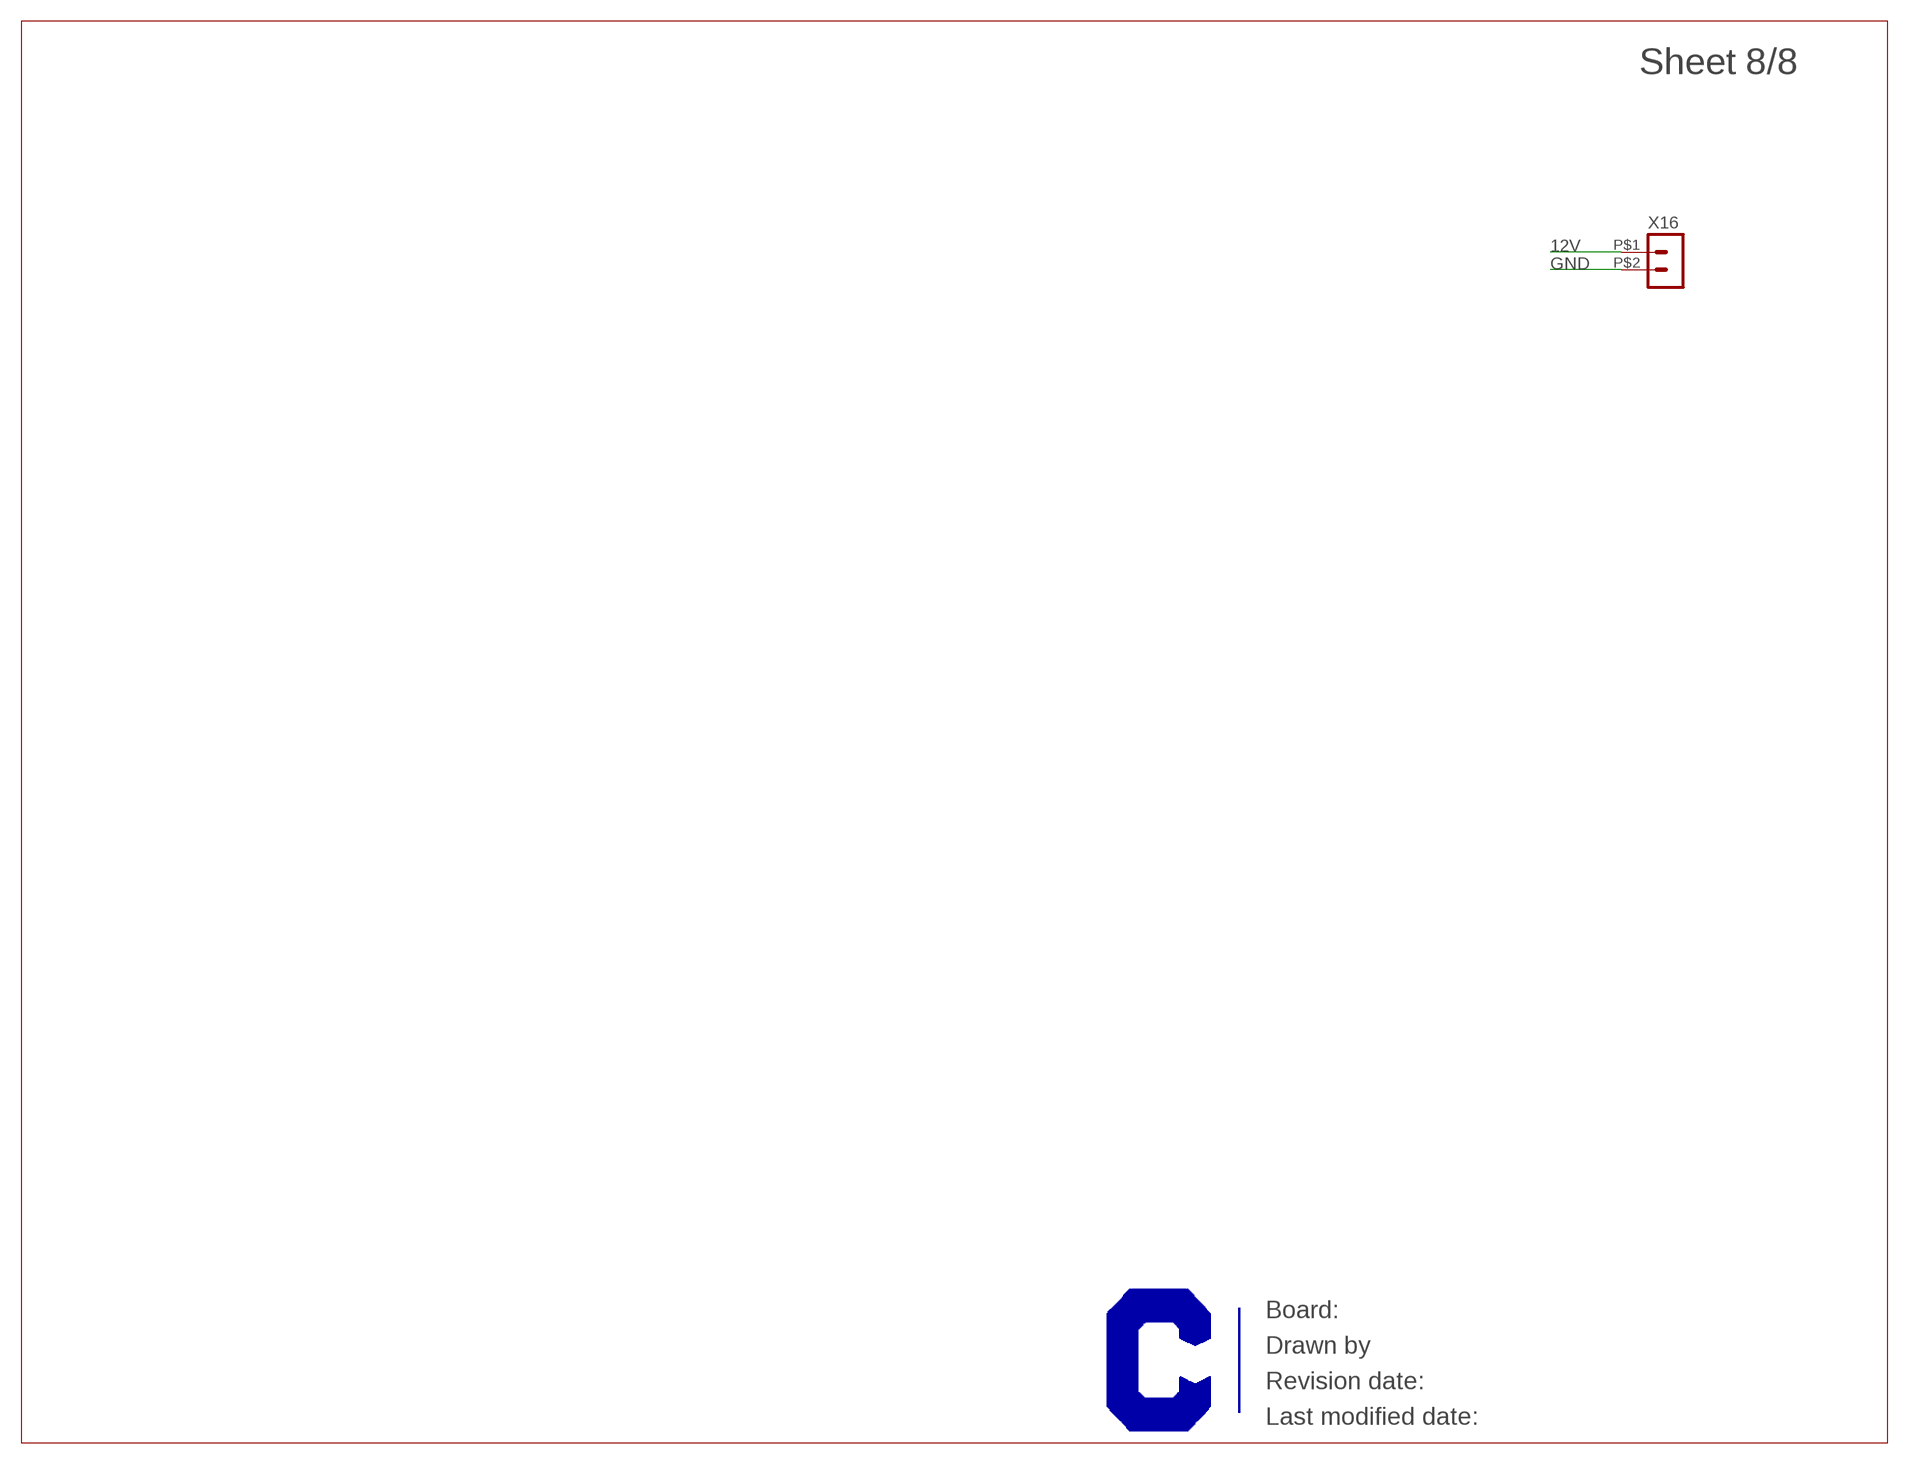
[diagram p7: schematic, sheet 8]

### Parts
X16  HEADER_POS2_43045-0200  [43045-0200]

### Nets
12V [Supply]: X16.P$1 ; also sheet 1,2,3,4,5,6,7
GND [Supply]: X16.P$2 ; also sheet 1,2,3,4,5,6,7

## Library data of the parts
C1-C32 C37 C38 = resistor:C-US: CAPACITOR, American symbol
PAD1-PAD42 PAD44-PAD59 = wirepad:2,54/0,9: THROUGH-HOLE PAD
R1-R64 R73-R76 = rcl:R-US_: RESISTOR, American symbol
X1 X4 X7 X10 X13 = Harwin:M22-71403XX: M22-71403XX - 2x3 pos female header assy, 2.0mm pitch Datasheet: https://cdn.harwin.com/pdfs/M22-714.pdf; PARTNO: M22-7140342
X2 X3 X5 X6 X8 X9 X11 X12 X14 X15 = Harwin:M22-71310XX: Harwin M22-71310XX - 10pos single row female pin hdr, 2mm pitch Datasheet: https://cdn.harwin.com/pdfs/M22-713.pdf; PARTNO: M22-7131042
X16 = con-molex-micro-fit-3_0:HEADER_POS2_?: Molex - Micro-Fit 3.0 Series connector, 3.00mm (0.118") pitch header, 2 positions.
X17-X21 = Molex:MICROFIT-06-DUAL: Molex MicroFit 3.00mm Pitch Header, Surface Mount, Dual Row, 6 Circuits Note, November 2014: These come in three styles: Through-hole, with metal clip retention to PCB (not currently represented) (cheapest) SMD, with solder tab retention (-SMD) (more expensive, commonly stocked) SMD, with metal clip retention (-SMD-CLIP_RETENTION) (most expensive, not often stocked) Please use them in that order! Drawing: http://www.molex.com/pdm_docs/sd/430450609_sd.pdf (right-angle) Information: http://www.molex.com/molex/products/datasheet.jsp?part=active/0430450618_PCB_HEADERS.xml; PARTNO: 43045-0601

## Net classes
1 Supply: width 0.508 mm

## Board
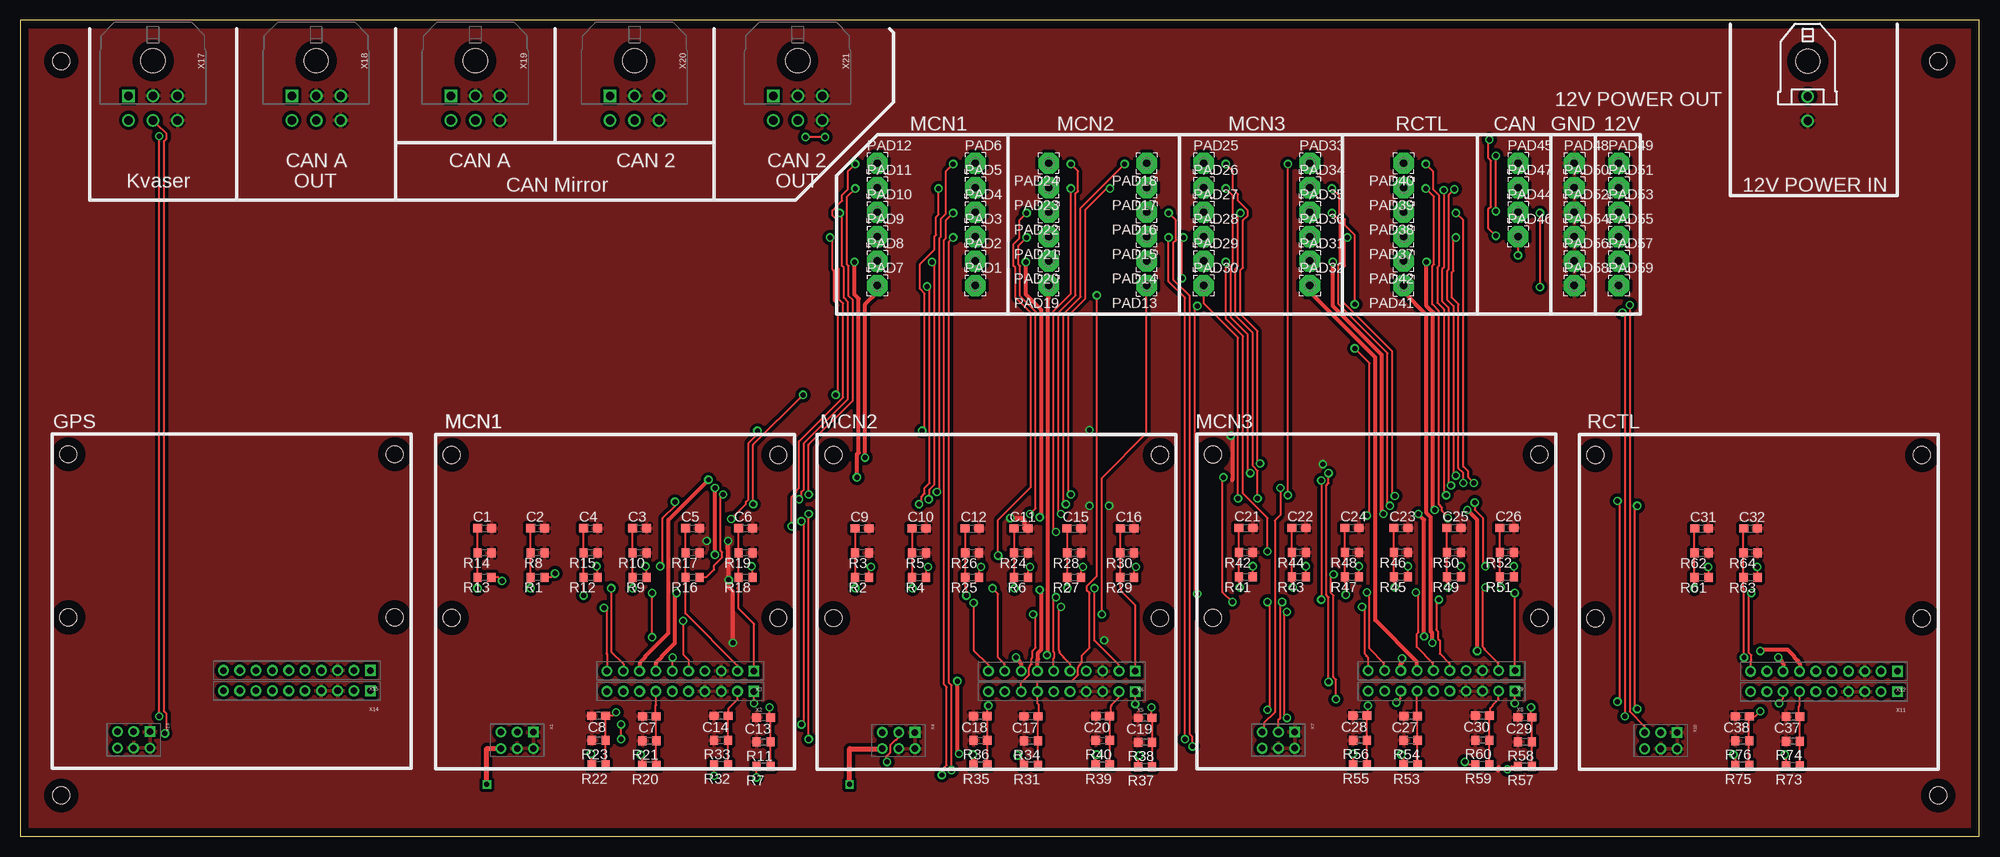
[diagram p8: board, top side]
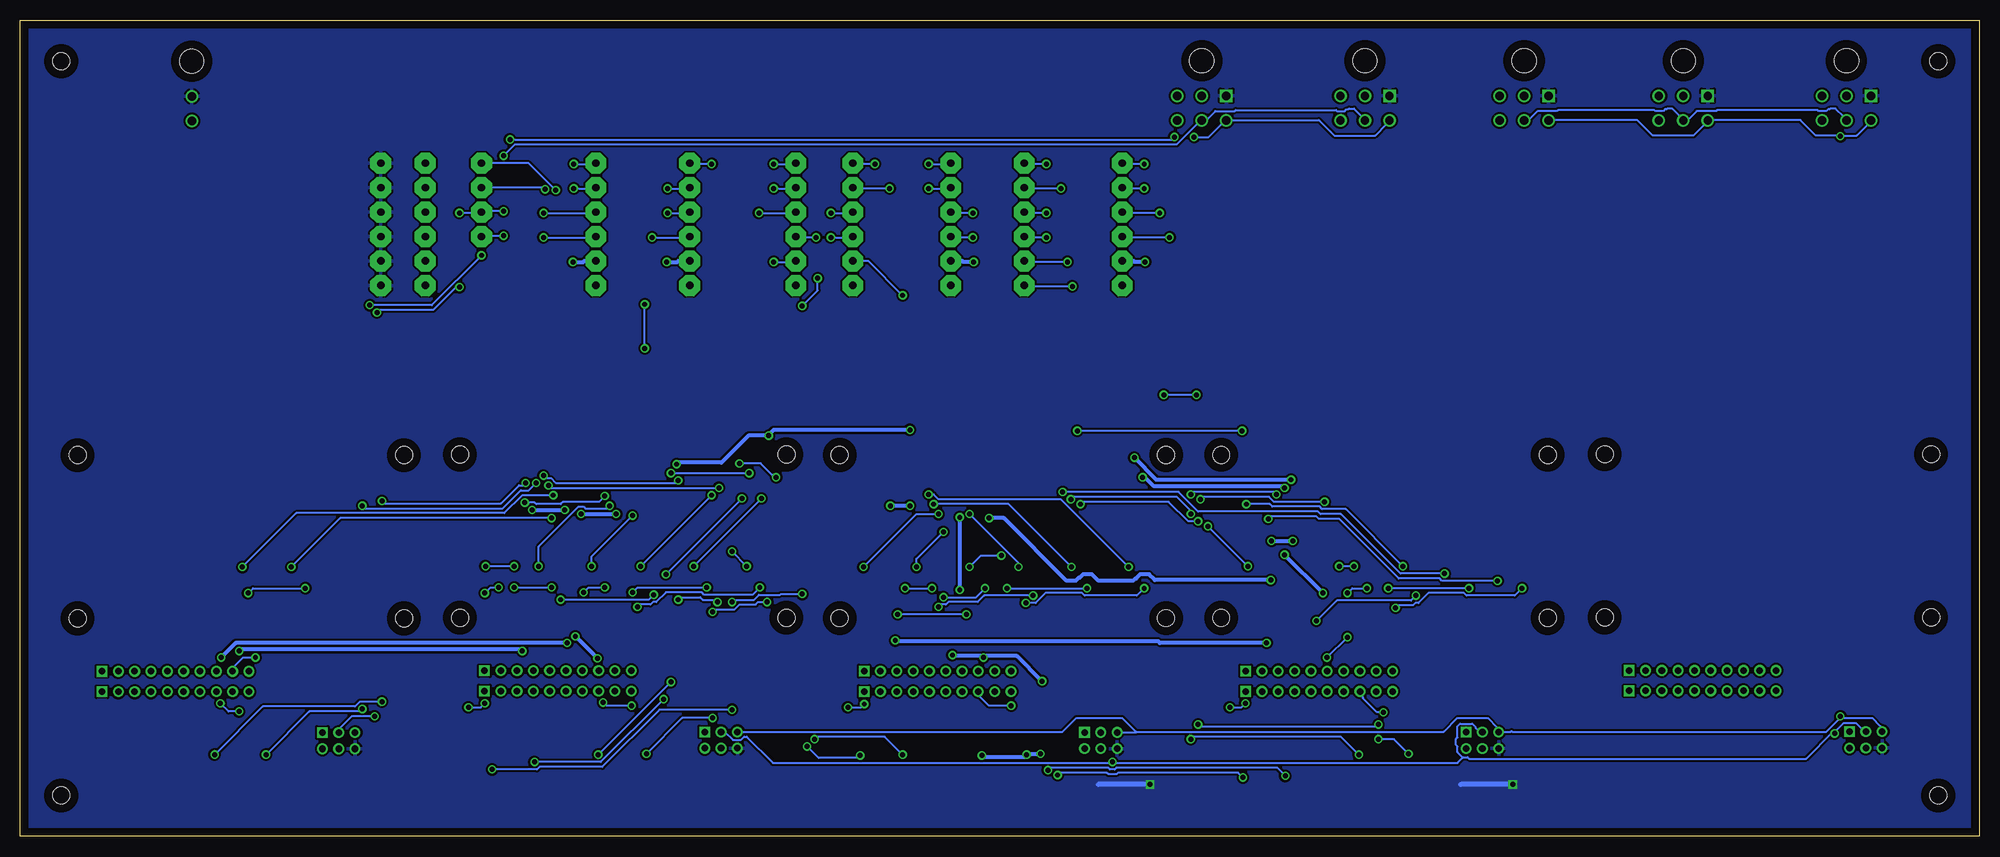
[diagram p9: board, bottom side, seen from below]

Size 240 x 100 mm. Coordinates in mm from the lower left corner, seen from the top.
Outline: 0,0 240,0 240,100 0,100 0,0
Copper layers (1*16): Top 0.035mm / dielectric 1.5mm / Bottom 0.035mm
Design rules "default *": minimum track width 10mil, minimum drill 24mil, track to track 10mil, track to pad 8mil, pad to pad 8mil, via to via 8mil, smd to smd 8mil, copper to edge 40mil, drill to drill 8mil, minimum pad ring 10mil, minimum via ring 8mil, stop-mask expansion 4mil, vias tented up to drill 0mil, thermal gap 10mil
Holes 2.1 mm at 92.86,26.75 92.86,46.76 52.87,46.76 52.87,26.75 139.62,26.73 139.62,46.73 99.61,46.73 99.61,26.73 186.15,26.79 186.15,46.78 146.15,46.78 146.15,26.79 233,26.71 233,46.72 193,46.72 193,26.71 45.88,26.82 45.88,46.83 5.88,46.83 5.88,26.82 5,95 5,5 235,5 235,95

### Footprints (pad centres in the part's own frame; a part is rotated, then mirrored left to right if it is on the bottom)
C0603 = smd 1.1 x 1: 1 -0.85,0; 2 0.85,0
2,54/0,9 = drill 0.914 pad 2.54 octagon: 1 0,0
R0603 = smd 1 x 1.1: 1 -0.85,0; 2 0.85,0
M22-71403XX = drill 0.8 square: 1 -1,2 | drill 0.8 round: 2 1,2; 3 -1,0; 4 1,0; 5 -1,-2; 6 1,-2
M22-71310XX = drill 0.8 square: 1 0,-9 | drill 0.8 round: 2 0,-7; 3 0,-5; 4 0,-3; 5 0,-1; 6 0,1; 7 0,3; 8 0,5; 9 0,7; 10 0,9
43045-0200 = drill 1.02 round: P$1 0,4.32; P$2 0,7.32 | hole 3: 0,0
MICROFIT-6-DUAL-RA-THROUGH_HOLE-PEG_RETENTION = drill 1.02 square: 1 3,0 | drill 1.02 round: 2 0,0; 3 -3,0; 4 3,3; 5 0,3; 6 -3,3 | hole 3: 0,-4.32

### Placement (x,y rotation side)
C1  56.87,37.76 0 top
C2  63.37,37.76 0 top
C3  75.86,37.76 0 top
C4  69.86,37.76 0 top
C5  82.36,37.76 0 top
C6  88.86,37.76 0 top
C7  77.06,14.71 180 top
C8  70.86,14.76 180 top
C9  103.11,37.73 0 top
C10  110.11,37.73 0 top
C11  122.61,37.73 0 top
C12  116.61,37.73 0 top
C13  91.06,14.55 180 top
C14  85.86,14.76 180 top
C15  129.12,37.73 0 top
C16  135.62,37.73 0 top
C17  123.81,14.69 180 top
C18  117.61,14.73 180 top
C19  137.81,14.54 180 top
C20  132.62,14.73 180 top
C21  150.15,37.78 0 top
C22  156.65,37.78 0 top
C23  169.15,37.78 0 top
C24  163.15,37.78 0 top
C25  175.65,37.78 0 top
C26  182.15,37.78 0 top
C27  170.34,14.73 180 top
C28  164.15,14.79 180 top
C29  184.34,14.59 180 top
C30  179.15,14.79 180 top
C31  206,37.72 0 top
C32  212,37.72 0 top
C37  217.19,14.66 180 top
C38  211,14.71 180 top
PAD1  117,67.5 0 top
PAD2  117,70.5 0 top
PAD3  117,73.5 0 top
PAD4  117,76.5 0 top
PAD5  117,79.5 0 top
PAD6  117,82.5 0 top
PAD7  105,67.5 0 top
PAD8  105,70.5 0 top
PAD9  105,73.5 0 top
PAD10  105,76.5 0 top
PAD11  105,79.5 0 top
PAD12  105,82.5 0 top
PAD13  138,67.5 180 top
PAD14  138,70.5 180 top
PAD15  138,73.5 180 top
PAD16  138,76.5 180 top
PAD17  138,79.5 180 top
PAD18  138,82.5 180 top
PAD19  126,67.5 180 top
PAD20  126,70.5 180 top
PAD21  126,73.5 180 top
PAD22  126,76.5 180 top
PAD23  126,79.5 180 top
PAD24  126,82.5 180 top
PAD25  145,82.5 0 top
PAD26  145,79.5 0 top
PAD27  145,76.5 0 top
PAD28  145,73.5 0 top
PAD29  145,70.5 0 top
PAD30  145,67.5 0 top
PAD31  158,70.5 0 top
PAD32  158,67.5 0 top
PAD33  158,82.5 0 top
PAD34  158,79.5 0 top
PAD35  158,76.5 0 top
PAD36  158,73.5 0 top
PAD37  169.5,73.5 180 top
PAD38  169.5,76.5 180 top
PAD39  169.5,79.5 180 top
PAD40  169.5,82.5 180 top
PAD41  169.5,67.5 180 top
PAD42  169.5,70.5 180 top
PAD44  183.5,76.5 0 top
PAD45  183.5,82.5 0 top
PAD46  183.5,73.5 0 top
PAD47  183.5,79.5 0 top
PAD48  190.4,82.5 0 top
PAD49  195.85,82.5 0 top
PAD50  190.4,79.5 0 top
PAD51  195.85,79.5 0 top
PAD52  190.4,76.5 0 top
PAD53  195.85,76.5 0 top
PAD54  190.4,73.5 0 top
PAD55  195.85,73.5 0 top
PAD56  190.4,70.5 0 top
PAD57  195.85,70.5 0 top
PAD58  190.4,67.5 0 top
PAD59  195.85,67.5 0 top
R1  63.37,31.75 180 top
R2  103.11,31.73 180 top
R3  103.11,34.73 180 top
R4  110.11,31.73 180 top
R5  110.11,34.73 180 top
R6  122.61,31.73 180 top
R7  91.06,8.55 0 top
R8  63.37,34.76 180 top
R9  75.86,31.75 180 top
R10  75.86,34.76 180 top
R11  91.06,11.55 0 top
R12  69.86,31.75 180 top
R13  56.87,31.75 180 top
R14  56.87,34.76 180 top
R15  69.86,34.76 180 top
R16  82.36,31.75 180 top
R17  82.36,34.76 180 top
R18  88.86,31.75 180 top
R19  88.86,34.76 180 top
R20  77.06,8.71 0 top
R21  77.06,11.71 0 top
R22  70.86,8.76 0 top
R23  70.86,11.76 0 top
R24  122.61,34.73 180 top
R25  116.61,31.73 180 top
R26  116.61,34.73 180 top
R27  129.12,31.73 180 top
R28  129.12,34.73 180 top
R29  135.62,31.73 180 top
R30  135.62,34.73 180 top
R31  123.81,8.69 0 top
R32  85.86,8.76 0 top
R33  85.86,11.76 0 top
R34  123.81,11.69 0 top
R35  117.61,8.73 0 top
R36  117.61,11.73 0 top
R37  137.81,8.54 0 top
R38  137.81,11.54 0 top
R39  132.62,8.73 0 top
R40  132.62,11.73 0 top
R41  150.15,31.79 180 top
R42  150.15,34.78 180 top
R43  156.65,31.79 180 top
R44  156.65,34.78 180 top
R45  169.15,31.79 180 top
R46  169.15,34.78 180 top
R47  163.15,31.79 180 top
R48  163.15,34.78 180 top
R49  175.65,31.79 180 top
R50  175.65,34.78 180 top
R51  182.15,31.79 180 top
R52  182.15,34.78 180 top
R53  170.34,8.73 0 top
R54  170.34,11.73 0 top
R55  164.15,8.79 0 top
R56  164.15,11.79 0 top
R57  184.34,8.59 0 top
R58  184.34,11.59 0 top
R59  179.15,8.79 0 top
R60  179.15,11.79 0 top
R61  206,31.71 180 top
R62  206,34.72 180 top
R63  212,31.71 180 top
R64  212,34.72 180 top
R73  217.19,8.66 0 top
R74  217.19,11.66 0 top
R75  211,8.71 0 top
R76  211,11.71 0 top
X1  60.87,11.76 270 top
X2  80.86,17.75 90 top
X3  80.86,20.25 90 top
X4  107.61,11.73 270 top
X5  127.61,17.73 90 top
X6  127.61,20.23 90 top
X7  154.15,11.79 270 top
X8  174.15,17.79 90 top
X9  174.15,20.29 90 top
X10  201,11.71 270 top
X11  221,17.71 90 top
X12  221,20.21 90 top
X13  13.88,11.82 270 top
X14  33.88,17.82 90 top
X15  33.88,20.32 90 top
X16  219,95 180 top
X17  16.25,90.75 180 top
X18  36.25,90.75 180 top
X19  55.75,90.75 180 top
X20  75.25,90.75 180 top
X21  95.25,90.75 180 top

### Tracks (layer width: path | path; a pad name or v marks a point on that pad's centre or on a via)
3V3_MCN1  (via drill 0.61)
  Top 0.508: v84.3,43.7 79.4,38.8 79.4,24.9 76.6,22.1 76.6,22 75.9,21.3 75.9,20.3 X3.8 | v103.5,46.4 103.5,65.2 105,66.7 PAD7.1
  Bottom 0.508: v84.3,43.7 100.8,43.7 v103.5,46.4
3V3_MCN2  (via drill 0.61)
  Top 0.508: v116.7,10 116.7,9.6 116.8,9.5 116.8,8.8 R35.1 | v122.2,9.9 122.8,9.3 122.8,9.2 123,9 123,8.7 R31.1 | v122,21.9 122.4,21.5 122.4,21.4 122.6,21.2 122.6,20.3 X6.8 | v114.8,19 114.8,10.3 v115,10.1 | PAD19.1 126,66 125.9,65.9 125.9,22.3 v125.8,22.2
  Bottom 0.508: v122.2,9.9 122,9.7 117,9.7 v116.7,10 116.5,10.1 v115,10.1 | v114.8,19 117.9,22.1 121.8,22.1 v122,21.9 122.1,22.1 125.7,22.1 v125.8,22.2
3V3_MCN3  (via drill 0.61)
  Top 0.508: v169.3,21.8 169.3,21.3 169.1,21.1 169.1,20.3 X9.8 | v172,24.5 172,38.8 v171.3,39.5 | v167,39.5 166.8,39.7 166.8,59 160.8,65 v160.8,70.4
  Bottom 0.508: v169.3,21.8 v172,24.5 | v171.3,39.5 v167,39.5 | v160.8,70.4 159.5,70.4 159.4,70.5 PAD31.1
3V3_RCTL  (via drill 0.61)
  Top 0.508: v215.4,21.9 215.8,21.5 215.8,21.4 216,21.2 216,20.3 X12.8 | v173,23.7 173,24.9 172.8,25.1 172.8,39.1 172.3,39.6 172.3,63.9 169.5,66.7 PAD41.1
  Bottom 0.508: v215.4,21.9 213.6,23.7 v173,23.7
5V_MCN1  (via drill 0.61)
  Top 0.508: v80.4,29.8 80.2,29.6 80.2,23.7 78.6,22.1 78.6,22 77.9,21.3 77.9,20.3 X3.7 | v85.1,34.5 v85.1,42.7 | v102.5,44 102.5,46.8 102.7,47 102.7,65.9 102.2,66.4 v102.2,70.4
  Bottom 0.508: v80.4,29.8 v85.1,34.5 | v85.1,42.7 85.3,42.9 101.1,42.9 102.2,44 v102.5,44 | v102.2,70.4 103.5,70.4 103.6,70.5 PAD8.1
5V_MCN2  (via drill 0.61)
  Top 0.508: v124.9,30.2 125.1,30 125.1,22.9 124.7,22.5 124.7,21.7 124.6,21.6 124.6,20.3 X6.7 | v124.9,39.1 125.1,39.3 125.1,64.5 123.2,66.4 v123.2,70.4
  Bottom 0.508: v124.9,30.2 v124.9,39.1 | v123.2,70.4 124.5,70.4 124.6,70.5 PAD20.1
5V_MCN3
  Top 0.508: PAD32.1 158,66.7 166,58.7 166,26.5 171.1,21.4 171.1,20.3 X9.7
5V_RCTL  (via drill 0.61)
  Top 0.508: v213.2,22.7 213.4,22.9 216.5,22.9 217.3,22.1 217.3,22 217.8,21.5 217.8,21.4 218,21.2 218,20.3 X12.7 | v178.5,22.7 178.5,38.8 v177.3,40 | v173.3,40 173.1,40.2 173.1,64.2 172.3,65 v172.3,70.4
  Bottom 0.508: v213.2,22.7 213,22.9 178.7,22.9 v178.5,22.7 | v177.3,40 v173.3,40 | v172.3,70.4 171,70.4 170.9,70.5 PAD42.1
12V  (via drill 0.6)
  Top 0.61: X1.6 57.15,10.76 v57.15,6.35 | X4.6 101.6,10.73 v101.6,6.35
  Bottom 0.61: v57.15,6.35 63.5,6.35 | v101.6,6.35 107.95,6.35
  pour Bottom: 0,0 240,0 240,100 0,100
AIN2_RCTL  (via drill 0.61)
  Top 0.254: C32.1 211.1,37.7 211.1,34.8 R64.2 211.1,34.7 211.1,31.8 R63.2 211.1,31.6 211.1,30.4 211.2,30.3 v211.2,21.9
  Bottom 0.254: v211.2,21.9 212.7,21.9 213.9,20.7 213.9,20.3 X12.9
AIN6_MCN2
  Top 0.254: C16.1 134.8,37.7 134.8,34.8 R30.2 134.8,34.7 134.8,31.8 R29.2 134.8,31.7 134.8,30.5 134.9,30.4 134.9,30 136.6,28.3 136.6,20.3 X6.1
AIN6_MCN3  (via drill 0.61)
  Top 0.254: C26.1 181.3,37.7 181.3,34.9 R52.2 181.3,34.7 R51.2 181.3,31.7 181.3,31.1 181.4,31 v181.4,30.5 | v183.1,29.8 183.1,20.3 X9.1
  Bottom 0.254: v183.1,29.8 182.4,30.5 v181.4,30.5
AIN7_MCN1  (via drill 0.61)
  Top 0.254: R7.2 91.9,8.6 91.9,11.5 R11.2 91.9,11.6 91.9,14.5 C13.1 91.8,14.5 91.7,14.6 91.8,14.7 v91.8,15.8 | v89.9,16.3 89.9,17.7 X2.1
  Bottom 0.254: v89.9,16.3 90.4,15.8 v91.8,15.8
AIN7_MCN2  (via drill 0.61)
  Top 0.254: R37.2 138.7,8.6 138.7,11.5 R38.2 138.7,11.6 138.7,14.5 C19.1 138.6,14.6 v138.6,15.8 | v136.6,16.2 136.6,17.7 X5.1
  Bottom 0.254: v136.6,16.2 137,15.8 v138.6,15.8
AIN7_MCN3  (via drill 0.61)
  Top 0.254: R57.2 185.2,11.5 R58.2 185.2,11.7 185.2,14.5 C29.1 185.1,14.5 185,14.6 185.1,14.7 v185.1,15.8 | v183.1,16.3 183.1,17.7 X8.1
  Bottom 0.254: v183.1,16.3 183.6,15.8 v185.1,15.8
AIN8_MCN1
  Top 0.254: R32.2 86.7,8.8 86.7,11.7 R33.2 86.7,11.8 86.7,14.7 C14.1 86.8,14.7 86.9,14.8 86.8,14.9 86.8,15.7 87.9,16.8 87.9,17.7 X2.2
AIN8_MCN2
  Top 0.254: R39.2 133.5,8.8 133.5,11.7 R40.2 133.5,11.8 133.5,14.7 C20.1 133.6,14.6 133.7,14.7 133.6,14.8 133.6,15.9 133.7,16 133.7,16.1 134.6,17 134.6,17.7 X5.2
AIN8_MCN3
  Top 0.254: R59.2 180,11.7 R60.2 180,11.9 180,14.7 C30.1 180.1,14.7 180.2,14.8 180.1,14.9 180.1,15.7 180.4,16 180.4,16.1 181.1,16.8 181.1,17.7 X8.2
CAN2_H  (via drill 0.61)
  Top 0.254: v197.2,65.1 197.2,15.3 199,13.5 199,12.8 X10.5 | PAD46.1 v183.5,71.2 | v98.6,85.7 v96.2,85.7 | v180,85.4 179.9,85.3 179.9,83.1 180.2,82.8 180.2,77.2 179.9,76.9 179.9,74.5 v180.8,73.6
  Bottom 0.254: X20.4 72.3,87.8 72.6,87.8 72.6,87.3 74,85.9 79,85.9 80.9,87.8 92.2,87.8 X21.4 92.6,87.4 92.7,87.4 94.4,85.7 v96.2,85.7 | v197.2,65.1 189.6,65.1 v183.5,71.2 | v98.6,85.7 98.9,85.4 v180,85.4 | v180.8,73.6 182.4,73.6 182.5,73.5 PAD46.1
CAN2_L  (via drill 0.61)
  Top 0.254: v196.6,14.7 196.6,63.9 v196.3,64.2 | v186.2,76.4 v186.2,67.3 | v180.8,76.6 v180.8,83.4
  Bottom 0.254: X20.5 75.3,87.8 75.6,87.8 75.6,88.2 76.6,89.2 77.2,89.2 77.3,89.1 77.5,89.1 77.7,88.9 78.7,88.9 78.8,89 91.1,89 91.2,88.9 93.6,88.9 94.7,87.8 95.2,87.8 X21.5 95.6,87.4 95.7,87.4 98.3,84.8 179.4,84.8 v180.8,83.4 | v196.6,14.7 199.4,14.7 200.9,13.2 200.9,12.8 X10.3 | v196.3,64.2 196,64.5 189.4,64.5 186.6,67.3 v186.2,67.3 | v186.2,76.4 184.6,76.4 184.5,76.5 PAD44.1 182.5,76.5 182.4,76.6 v180.8,76.6
CANA_H  (via drill 0.61)
  Top 0.254: v174.4,79.2 174.4,69.7 174.2,69.5 174.2,65.6 175,64.8 175,43.3 v175.3,43 | v154.4,42.7 154.4,39.4 153.7,38.7 153.7,15.2 152.4,13.9 152.4,13.4 152.1,13.1 152.1,12.8 X7.5 | v17,14.7 v17,85.8
  Bottom 0.254: 17,85.9 15,85.9 13.6,87.3 13.6,87.8 13.3,87.8 X17.4 | 17,85.9 20,85.9 21.9,87.8 33.2,87.8 X18.4 33.3,87.8 33.6,87.8 33.6,87.3 35,85.9 40,85.9 41.9,87.8 52.7,87.8 X19.4 | 17,14.5 18.7,12.8 57.2,12.8 57.3,12.9 57.4,12.8 58.8,12.8 X1.5 58.9,12.8 59,12.8 59,13.3 60.2,14.5 63.9,14.5 65.6,12.8 103.3,12.8 | 17,14.5 13.1,14.5 12.1,13.5 12.1,13.4 12,13.3 12,12.8 11.9,12.8 X13.5 | 103.3,12.8 105,14.5 110.6,14.5 112.3,12.8 152.1,12.8 X7.5 | X4.5 105.6,12.7 103.3,12.7 103.3,12.8 | PAD45.1 177.7,82.5 v174.4,79.2 | v175.3,43 175,42.7 v154.4,42.7 | v17,85.8 17,85.9 | 17,14.5 v17,14.7
CANA_L  (via drill 0.61)
  Top 0.254: v106.2,9.1 106.2,9.4 106.1,9.5 106.1,9.8 106.6,10.3 106.6,11.2 107.2,11.8 107.3,11.8 107.6,12.1 107.6,12.7 X4.3 | v175.7,79.3 175,78.6 175,69.5 174.8,69.3 174.8,65.8 175.6,65 175.6,44.5 v175.9,44.2 | v159.4,43.6 v159.4,29 | v154.6,28.7 154.3,28.4 154.3,14.4 154.1,14.2 154.1,12.8 X7.3 | v17.7,12.6 17.9,12.8 17.9,15 17.6,15.3 17.6,85.2 17.9,85.5 17.9,86.1 16.7,87.3 16.4,87.3 16.3,87.4 16.3,87.7 X17.5
  Bottom 0.254: X17.5 16.3,87.8 16.6,87.8 16.6,88.2 17.6,89.2 18.2,89.2 18.3,89.1 18.5,89.1 18.7,88.9 19.7,88.9 19.8,89 32.1,89 32.2,88.9 34.6,88.9 35.7,87.8 36.2,87.8 X18.5 36.3,87.8 36.6,87.8 36.6,88.2 37.6,89.2 38.2,89.2 38.3,89.1 38.5,89.1 38.7,88.9 39.7,88.9 39.8,89 51.6,89 51.7,88.9 54.1,88.9 55.2,87.8 55.7,87.8 X19.5 | 63.3,9.7 63.9,10.3 63.9,11 64.1,11.2 64.1,11.9 63.9,12.1 63.9,13.5 63.6,13.8 62.1,13.8 61.7,13.4 61.7,13.3 61.2,12.8 60.9,12.8 X1.3 | 63.3,9.7 62.7,9.7 62.5,9.5 21.2,9.5 17.9,12.8 17.7,12.8 | 17.7,12.8 16.6,13.9 15.1,13.9 14,12.8 13.9,12.8 X13.3 | 106.2,9 63.9,9 63.3,9.6 63.3,9.7 | 106.2,9 147.8,9 151,12.2 151.3,12.2 151.7,11.8 152.7,11.8 153.7,12.8 154.1,12.8 X7.3 | 106.2,9 v106.2,9.1 | PAD47.1 175.9,79.5 v175.7,79.3 | v175.9,44.2 175.6,43.9 175,43.9 174.4,43.3 159.7,43.3 v159.4,43.6 | v159.4,29 159.1,29.3 156.7,29.3 156.4,29 154.9,29 v154.6,28.7 | 17.7,12.8 v17.7,12.6
FLEX1  (via drill 0.61)
  Top 0.254: v170,33.1 R45.1 | v165,39.3 165.3,39.6 165.3,58 v163.5,59.8 | v163.5,65.2 163.5,73.7 162.3,74.9 162.3,75.6 161.6,76.3 161.6,78.5 v160.7,79.4
  Bottom 0.254: v170,33.1 170,34.3 v165,39.3 | v163.5,59.8 v163.5,65.2 | v160.7,79.4 159.1,79.4 159,79.5 PAD34.1
FLEX1_MCN3  (via drill 0.61)
  Top 0.254: C23.1 168.3,37.7 168.3,34.9 R46.2 168.3,34.7 R45.2 168.3,31.7 168.3,31.1 168.4,31 v168.4,30.5 | v171,29.9 171.3,29.6 171.3,25 171.1,24.8 171.1,23.2 173.1,21.2 173.1,20.3 X9.6
  Bottom 0.254: v171,29.9 170.4,30.5 v168.4,30.5
FLEX2  (via drill 0.61)
  Top 0.254: v164,33.1 R47.1 | v155.3,41.8 v155.3,82.4
  Bottom 0.254: v164,33.1 v155.3,41.8 | v155.3,82.4 156.9,82.4 157,82.5 PAD33.1
FLEX2_MCN3  (via drill 0.61)
  Top 0.254: C24.1 162.3,37.7 162.3,34.9 R48.2 162.3,34.7 R47.2 162.3,31.7 162.3,31.1 162.4,31 v162.4,29.6 | v173.8,29 173.5,28.7 173.5,25.3 173.7,25.1 173.7,24.2 173.9,24 173.9,22.4 175.1,21.2 175.1,20.3 X9.5
  Bottom 0.254: v173.8,29 163,29 v162.4,29.6
FLEX3  (via drill 0.61)
  Top 0.254: v176.5,33.1 R49.1 | v167.8,40.5 167.5,40.8 167.5,59.2 161.5,65.2 161.5,69.9 161.7,70.1 161.7,75.4 v160.7,76.4
  Bottom 0.254: v176.5,33.1 176.5,35.5 171.6,40.4 171,40.4 170.8,40.2 168.1,40.2 v167.8,40.5 | v160.7,76.4 159.1,76.4 159,76.5 PAD35.1
FLEX3_MCN3  (via drill 0.61)
  Top 0.254: C25.1 174.8,37.7 174.8,34.9 R50.2 174.8,34.7 R49.2 174.8,31.7 174.8,31.1 174.9,31 v174.9,30.5 | v179.5,30.5 179.2,30.2 179.2,23.2 179.4,23 179.4,22.9 181.1,21.2 181.1,20.3 X9.2
  Bottom 0.254: v179.5,30.5 v174.9,30.5
FLOW_MCTLLOOP_MCN2  (via drill 0.61)
  Top 0.254: R31.2 124.7,8.7 124.7,11.6 R34.2 124.7,11.8 124.7,14.6 C17.1 124.8,14.6 124.8,16.1 124.6,16.3 124.6,17.7 X5.7 124.6,17.8 124.6,19 128.8,19 129.6,19.8 129.6,20.7 129.7,20.8 129.7,20.9 130.1,21.3 130.1,22.2 131,23.1 131,29.8 130.7,30.1 130.7,30.7 131.9,31.9 v131.9,66.3
  Bottom 0.254: PAD14.1 136.1,70.5 v131.9,66.3
FLOW_MTRLOOP_MCN2  (via drill 0.61)
  Top 0.254: R35.2 118.5,8.8 118.5,11.7 R36.2 118.5,11.8 118.5,14.7 C18.1 118.5,14.8 118.5,15.7 118.6,15.8 v118.6,16 | PAD13.1 138,49.4 132.5,43.9 v132.5,27.2 | v124.1,27.2 124.4,26.9 124.4,23.1 124,22.7 124,21.9 123.9,21.8 123.9,21.1 123.7,20.9 123.7,20.8 123.6,20.7 123.6,19.8 122.6,18.8 122.6,17.8 X5.8
  Bottom 0.254: v118.6,16 121.3,16 122.6,17.3 122.6,17.7 X5.8 | v124.1,27.2 v132.5,27.2
GND  (via drill 0.61)
  Top 0.508: 181.1,8.47 181.1,8.3 181.1,8.2 181.08,8.06 | v148.3,49.1 148.5,48.9 148.5,43.8 148.46,43.65 | v87.3,23.7 87.3,30 86.8,30.5 v86.8,31.4 86.8,34.1 86.7,34.2 v86.7,36.2 | v121.3,39 122.8,39 123,38.8 123,37.7 123.3,37.7 C11.2
  Bottom 0.508: v159.6,45.6 159.4,45.8 154.1,45.8 150.8,49.1 v148.3,49.1 148.2,49.3 147.7,49.8 v131,49.8 | v132.8,24 132.7,23.9 100.6,23.9 100.4,23.7 v87.3,23.7 | v86.7,36.2 v84.1,36.2 | v86.8,31.4 101,31.4 101.7,32.1 102.8,32.1 103.3,31.6 103.4,31.6 103.7,31.3 107.9,31.3 108.7,32.1 109.8,32.1 110.2,31.7 110.3,31.7 110.7,31.3 111.8,31.3 119.5,39 v121.3,39 | v131,40.5 v133.4,40.5
  pour Top (isolate 0.406): 0,0 240,0 240,100 0,100
GP0_MCN1
  Top 0.254: R20.2 77.9,8.8 R21.2 77.9,11.8 C7.1 77.8,14.6 77.7,14.7 77.8,14.8 77.8,16 77.9,16.1 77.9,17.7 X2.7
GP0_MCN3
  Top 0.254: R53.2 171.2,8.8 171.2,9.4 171.1,9.5 171.1,10.3 171.2,10.4 171.2,11.7 R54.2 171.2,11.8 171.2,14.7 C27.1 171.1,14.8 171.1,17.7 X8.7
GP1_MCN1  (via drill 0.61)
  Top 0.254: R22.2 71.7,8.8 71.7,11.7 R23.2 71.7,11.8 71.7,14.7 C8.1 71.8,14.8 72.6,14.8 v73,15.2
  Bottom 0.254: v73,15.2 73.8,15.2 75.5,16.9 75.5,17 75.8,17.3 75.8,17.7 X2.8
GP1_MCN3  (via drill 0.61)
  Top 0.254: R55.2 165,11.7 R56.2 165,11.9 165,14.7 C28.1 165.1,14.7 165.2,14.8 165.1,14.9 v165.1,16 | v168.6,16.4 169.1,16.9 169.1,17.7 X8.8
  Bottom 0.254: v168.6,16.4 168.2,16 v165.1,16
GP1_MCN4  (via drill 0.61)
  Top 0.254: R75.2 211.8,8.8 211.8,11.7 R76.2 211.8,11.8 211.8,14.7 C38.1 211.9,14.7 212.6,14.7 v213.2,15.3 | v215.5,16.3 215.7,16.5 215.7,16.6 216,16.9 X11.8
  Bottom 0.254: v215.5,16.3 214.5,15.3 v213.2,15.3
PRES_AMB  (via drill 0.61)
  Top 0.254: v86.1,41.9 85.8,41.6 85.8,35 86,34.8 86,34.2 85,33.2 85,32.7 84.1,31.8 83.3,31.8 R16.1 | v96.6,41.9 96.6,48 102,53.4 102,65.7 101.5,66.2 101.5,69.9 101.3,70.1 101.3,78.4 v102.3,79.4
  Bottom 0.254: v86.1,41.9 86.4,42.2 96.3,42.2 v96.6,41.9 | v102.3,79.4 103.9,79.4 104,79.5 PAD11.1
PRES_AMB_MCN1
  Top 0.254: C5.1 81.5,37.7 81.5,34.8 R17.2 81.5,34.7 81.5,31.8 R16.2 81.5,31.7 81.5,27.3 87.9,20.9 87.9,20.3 X3.2
PRES_MTR_IN  (via drill 0.61)
  Top 0.254: v89.6,33.1 89.7,33 89.7,31.8 R18.1 | v94.5,38 94.5,41.6 95.1,42.2 95.1,42.4 95.4,42.7 95.4,48.4 100.8,53.8 100.8,65.3 100.3,65.8 100.3,69.5 100.1,69.7 100.1,75.5 99.5,76.1 99.5,76.7 100.7,77.9 100.7,78.6 101.4,79.3 101.4,81.5 v102.3,82.4
  Bottom 0.254: v89.6,33.1 v94.5,38 | v102.3,82.4 103.9,82.4 104,82.5 PAD12.1
PRES_MTR_IN_MCN1
  Top 0.254: C6.1 88,37.7 88,34.8 R19.2 88,34.7 88,31.8 R18.2 88,31.7 88,30.6 87.9,30.5 87.9,30.3 88,30.2 88,27.9 89.9,26 89.9,20.3 X3.1
STEER_ANG  (via drill 0.61)
  Top 0.254: v76.6,33.1 76.7,33 76.7,31.8 R9.1 | v78.4,33.1 78.7,33.4 78.7,39 80.2,40.5 v80.2,41 | v95.4,41.3 95.7,41.6 95.7,42.2 96,42.5 96,48.2 101.4,53.6 101.4,65.5 100.9,66 100.9,69.7 100.7,69.9 100.7,76.1 v100.4,76.4
  Bottom 0.254: v76.6,33.1 v78.4,33.1 | v80.2,41 86.4,41 87,41.6 95.1,41.6 v95.4,41.3 | v100.4,76.4 103.9,76.4 104,76.5 PAD10.1
STEER_ANG_MCN1  (via drill 0.61)
  Top 0.254: C3.1 75,37.7 75,34.8 R10.2 75,34.7 75,31.8 R9.2 75,31.7 v75,30.4 | v79.9,21.9 79.9,20.3 X3.6 | v77.4,24.4 v77.4,29.8
  Bottom 0.254: v79.9,21.9 v77.4,24.4 | v77.4,29.8 76.8,30.4 v75,30.4
SUSP_FRNT  (via drill 0.61)
  Top 0.254: v59,31.3 58.5,31.8 57.8,31.8 R13.1 | v87.1,38.9 88.9,40.7 88.9,41 89.2,41.3 89.2,48.2 90.3,49.3 v90.3,49.7 | v110.5,49.7 110.8,50 110.8,66.5 110.2,67.1 110.2,70.1 112,71.9 112,73.5 112.2,73.7 112.2,75.9 112.5,76.2 v112.5,79.4
  Bottom 0.254: v59,31.3 65.8,31.3 66.1,31.6 71.1,31.6 78.4,38.9 80.9,38.9 81.2,39.2 86.8,39.2 v87.1,38.9 | v90.3,49.7 v110.5,49.7 | v112.5,79.4 115.9,79.4 116,79.5 PAD5.1
SUSP_FRNT_MCN1  (via drill 0.61)
  Top 0.254: C1.1 56,37.7 56,34.8 R14.2 56,34.7 56,31.8 R13.2 56,31.7 v56,30.4 | v71.5,28 71.8,27.7 71.8,22.4 71.9,22.3 71.9,20.3 X3.10
  Bottom 0.254: v71.5,28 71.2,28.3 69.4,28.3 69.1,28.6 68.7,28.6 67.5,29.8 63.1,29.8 62.8,29.5 56.9,29.5 v56,30.4
SUSP_REAR  (via drill 0.61)
  Top 0.254: v65.5,32.2 65.1,31.8 64.3,31.8 R1.1 | v112.3,42.2 112.6,42.5 112.6,73.3 112.8,73.5 112.8,75.7 113.4,76.3 113.4,81.5 v114.3,82.4
  Bottom 0.254: v65.5,32.2 70.9,32.2 78.2,39.5 80.7,39.5 81,39.8 95.7,39.8 98.1,42.2 v112.3,42.2 | v114.3,82.4 115.9,82.4 116,82.5 PAD6.1
SUSP_REAR_MCN1  (via drill 0.61)
  Top 0.254: C2.1 62.5,37.7 62.5,34.8 R8.2 62.5,34.7 62.5,31.8 R1.2 62.5,31.7 v62.5,30.4 | v72.4,30.4 72.4,22.6 73.9,21.1 73.9,20.3 X3.9
  Bottom 0.254: v62.5,30.4 v72.4,30.4
TEMP_AMB  (via drill 0.61)
  Top 0.254: v70.6,33.1 70.7,33 70.7,31.8 R12.1 | v89.8,40.7 89.8,48 v95.9,54.1 | v99.9,54.1 100.2,54.4 100.2,65.1 99.7,65.6 99.7,69.3 99.5,69.5 99.5,73.1 v99.2,73.4
  Bottom 0.254: v70.6,33.1 77.6,40.1 80.5,40.1 80.8,40.4 86.6,40.4 86.9,40.7 v89.8,40.7 | v95.9,54.1 v99.9,54.1 | v99.2,73.4 103.9,73.4 104,73.5 PAD9.1
TEMP_AMB_MCN1  (via drill 0.61)
  Top 0.254: C4.1 69,37.7 69,34.8 R15.2 69,34.7 69,31.8 R12.2 69,31.7 v69,29.5 | v81.2,26.4 81.2,22.3 81.9,21.6 81.9,20.3 X3.5
  Bottom 0.254: v81.2,26.4 78.7,28.9 69.6,28.9 v69,29.5
TEMP_CLNT_MCTL_IN  (via drill 0.61)
  Top 0.254: v123.7,33 123.5,32.8 123.5,31.8 R6.1 | v119.8,34.4 119.8,38.8 123.8,42.8 123.8,64.1 121.9,66 121.9,69.7 121.7,69.9 121.7,72.6 122.4,73.3 122.4,75.5 v123.3,76.4
  Bottom 0.254: v123.7,33 122.3,34.4 v119.8,34.4 | v123.3,76.4 124.9,76.4 125,76.5 PAD22.1
TEMP_CLNT_MCTL_IN_MCN2  (via drill 0.61)
  Top 0.254: C11.1 121.8,37.7 121.8,34.8 R24.2 121.8,34.7 121.8,31.8 R6.2 121.8,31.7 v121.8,30.4 | v126.9,29.3 126.6,29 126.6,22.6 126.7,22.5 126.7,21.9 126.6,21.8 126.6,20.3 X6.6
  Bottom 0.254: v126.9,29.3 122.9,29.3 v121.8,30.4
TEMP_CLNT_MCTL_OUT  (via drill 0.61)
  Top 0.254: v117.7,33 117.5,32.8 117.5,31.8 R25.1 | v123.7,39.5 124.4,40.2 124.4,64.3 122.5,66.2 122.5,69.9 122.3,70.1 122.3,72.4 v123.3,73.4
  Bottom 0.254: v117.7,33 117.7,33.5 v123.7,39.5 | v123.3,73.4 124.9,73.4 125,73.5 PAD21.1
TEMP_CLNT_MCTL_OUT_MCN2  (via drill 0.61)
  Top 0.254: C12.1 115.8,37.7 115.8,34.8 R26.2 115.8,34.7 115.8,31.8 R25.2 115.8,31.7 115.8,30.5 115.9,30.4 v115.9,29.5 | v127.5,28.1 127.2,27.8 127.2,22.8 127.3,22.7 127.3,22.5 127.8,22 127.8,21.9 128.6,21.1 128.6,20.3 X6.5
  Bottom 0.254: v127.5,28.1 127.2,28.4 126.6,28.4 126.3,28.7 122.7,28.7 121.9,29.5 v115.9,29.5
TEMP_CLNT_MTR_IN  (via drill 0.61)
  Top 0.254: v104.2,33 104,32.8 104,31.8 R2.1 | v128.7,41.9 128.4,42.2 128.4,63.8 130.5,65.9 130.5,76.8 133.1,79.4 v133.5,79.4
  Bottom 0.254: v104.2,33 112.5,41.3 127.5,41.3 128.1,41.9 v128.7,41.9 | v133.5,79.4 136.9,79.4 137,79.5 PAD17.1
TEMP_CLNT_MTR_IN_MCN2  (via drill 0.61)
  Top 0.254: C9.1 102.3,37.7 102.3,34.8 R3.2 102.3,34.7 102.3,31.8 R2.2 102.3,31.7 v102.3,30.4 | v116.8,28.6 116.8,22.8 118.6,21 118.6,20.3 X6.10
  Bottom 0.254: v116.8,28.6 115.6,28.6 114.4,29.8 109.9,29.8 109.6,29.5 103.2,29.5 v102.3,30.4
TEMP_CLNT_MTR_OUT  (via drill 0.61)
  Top 0.254: v111.2,33 111,32.8 111,31.8 R4.1 | v128.1,40.7 127.8,41 127.8,64 129.9,66.1 129.9,77 v135.3,82.4
  Bottom 0.254: v111.2,33 118.9,40.7 v128.1,40.7 | v135.3,82.4 136.9,82.4 137,82.5 PAD18.1
TEMP_CLNT_MTR_OUT_MCN2  (via drill 0.61)
  Top 0.254: C10.1 109.3,37.7 109.3,34.8 R5.2 109.3,34.7 109.3,31.8 R4.2 109.3,31.7 v109.3,30.4 | v119.1,30.4 119.8,29.7 119.8,21.9 120.6,21.1 120.6,20.3 X6.9
  Bottom 0.254: v119.1,30.4 v109.3,30.4
TEMP_CONTACTOR_BOX  (via drill 0.61)
  Top 0.254: v130.2,33 130,32.8 130,31.8 R27.1 | v126.9,37.3 126.6,37.6 126.6,64.4 128.7,66.5 v128.7,79.4
  Bottom 0.254: v130.2,33 130.2,34 v126.9,37.3 | v128.7,79.4 127.1,79.4 127,79.5 PAD23.1
TEMP_CONTACTOR_BOX_MCN2  (via drill 0.61)
  Top 0.254: C15.1 128.3,37.7 128.3,34.8 R28.2 128.3,34.7 128.3,31.8 R27.2 128.3,31.7 v128.3,30.4 | v131.6,30.4 131.6,24 134.6,21 134.6,20.3 X6.2
  Bottom 0.254: v131.6,30.4 v128.3,30.4
TEMP_TIRE_FRNT  (via drill 0.61)
  Top 0.254: v151,33.1 R41.1 | v152.8,34.9 152.8,39 149.8,42 149.8,61.3 147.7,63.4 v147.7,70.4
  Bottom 0.254: v151,33.1 v152.8,34.9 | v147.7,70.4 146.1,70.4 146,70.5 PAD29.1
TEMP_TIRE_FRNT_MCN3  (via drill 0.61)
  Top 0.254: C21.1 149.3,37.7 149.3,34.9 R42.2 149.3,34.7 R41.2 149.3,31.7 149.3,31.1 149.4,31 v149.4,30.5 | v164.4,28.1 164.7,27.8 164.7,22.4 164.9,22.2 164.9,22.1 165.1,21.9 165.1,20.3 X9.10
  Bottom 0.254: v164.4,28.1 164.1,28.4 162.8,28.4 162.5,28.7 162.1,28.7 160.9,29.9 156.5,29.9 156.2,29.6 150.3,29.6 v149.4,30.5
TEMP_TIRE_REAR  (via drill 0.61)
  Top 0.254: v157.5,33.1 R43.1 | v149.2,41.4 149.2,61.1 145,65.3 PAD30.1
  Bottom 0.254: v157.5,33.1 v149.2,41.4
TEMP_TIRE_REAR_MCN3  (via drill 0.61)
  Top 0.254: C22.1 155.8,37.7 155.8,34.9 R44.2 155.8,34.7 R43.2 155.8,31.7 155.8,31.1 155.9,31 v155.9,30.5 | v165,29.9 165.3,29.6 165.3,23 167.1,21.2 167.1,20.3 X9.9
  Bottom 0.254: v165,29.9 164.4,30.5 v155.9,30.5
THRTL_EN  (via drill 0.61)
  Top 0.254: v216.2,10 216.3,9.9 216.3,8.7 R73.1 | v195.7,16.5 196,16.8 196,40.8 v195.7,41.1 | v178.1,43.3 177.4,44 177.4,44.7 176.8,45.3 176.8,75.5 v175.9,76.4
  Bottom 0.254: v216.2,10 210.3,15.9 199,15.9 198.4,16.5 v195.7,16.5 | v195.7,41.1 195.4,40.8 181.1,40.8 178.9,43 178.4,43 v178.1,43.3 | v175.9,76.4 170.6,76.4 170.5,76.5 PAD38.1
THRTL_EN_RCTL
  Top 0.254: R73.2 218,8.7 218,11.6 R74.2 218,11.7 218,14.6 C37.1 217.9,14.6 217.9,15.9 218,16 X11.7
THRTL_POS  (via drill 0.61)
  Top 0.254: v206.8,33 206.8,31.8 R61.1 | v174.9,39 174.9,39.2 174.2,39.9 174.2,40.3 173.8,40.7 173.8,64.4 173,65.2 173,69.9 173.2,70.1 173.2,78.4 v172.2,79.4
  Bottom 0.254: v206.8,33 200.8,39 v174.9,39 | v172.2,79.4 170.6,79.4 170.5,79.5 PAD39.1
THRTL_POS_RCTL  (via drill 0.61)
  Top 0.254: C31.1 205.1,37.7 205.1,34.8 R62.2 205.1,34.7 205.1,31.8 R61.2 205.1,31.6 v205.1,30.4 | v212.1,29.8 211.8,29.5 211.8,22.5 212.1,22.2 212.1,21.6 212,21.5 212,20.3 X12.10
  Bottom 0.254: v212.1,29.8 211.5,30.4 v205.1,30.4
UNUSED_A1  (via drill 0.61)
  Top 0.254: v90.2,7.2 90.2,8.5 R7.1 | v112.9,7.5 113.2,7.8 113.2,8.4 113.5,8.7 113.5,18.3 113.2,18.6 113.2,73.1 113.4,73.3 113.4,75.5 v114.3,76.4
  Bottom 0.254: v90.2,7.2 90.8,7.8 105.5,7.8 105.7,7.6 106.7,7.6 106.9,7.8 112.6,7.8 v112.9,7.5 | v114.3,76.4 115.9,76.4 116,76.5 PAD4.1
UNUSED_A2  (via drill 0.61)
  Top 0.254: v85,7.4 85,8.7 R32.1 | v114.1,8.1 114.1,18.5 113.8,18.8 113.8,72.9 v114.3,73.4
  Bottom 0.254: v85,7.4 86,8.4 105.7,8.4 105.9,8.2 106.5,8.2 106.7,8.4 113.8,8.4 v114.1,8.1 | v114.3,73.4 115.9,73.4 116,73.5 PAD3.1
UNUSED_A3  (via drill 0.61)
  Top 0.254: v136.7,33 136.5,32.8 136.5,31.8 R29.1 | v127.5,39.5 127.2,39.8 127.2,64.2 129.3,66.3 129.3,78.8 129.6,79.1 129.6,81.5 v128.7,82.4
  Bottom 0.254: v136.7,33 130.2,39.5 v127.5,39.5 | v128.7,82.4 127.1,82.4 127,82.5 PAD24.1
UNUSED_A4  (via drill 0.61)
  Top 0.254: v137.1,9.9 137.1,9.8 137,9.7 137,8.6 R37.1 | v143.6,11 143.6,12.2 143.3,12.5 143.3,66.2 141.3,68.2 141.3,72.8 141.6,73.1 141.6,75.5 v140.7,76.4
  Bottom 0.254: v137.1,9.9 137.4,9.6 142.2,9.6 v143.6,11 | v140.7,76.4 139.1,76.4 139,76.5 PAD16.1
UNUSED_A5  (via drill 0.61)
  Top 0.254: v131.9,10 131.8,9.9 131.8,8.8 R39.1 | v142.7,11.9 142.7,66 140.7,68 v140.7,73.4
  Bottom 0.254: v131.9,10 134.1,12.2 142.4,12.2 v142.7,11.9 | v140.7,73.4 139.1,73.4 139,73.5 PAD15.1
UNUSED_A6  (via drill 0.61)
  Top 0.254: v183,33.1 R51.1 | v179.5,33.1 179.2,33.4 179.2,39 178.2,40 v178.2,40.9 | v168.4,41.7 168.1,42 168.1,59.4 162.1,65.4 162.1,69.7 162.3,69.9 162.3,73.1 v162.6,73.4
  Bottom 0.254: v179.5,33.1 v183,33.1 | v178.2,40.9 177,40.9 176.8,40.7 173.8,40.7 173.5,41 169.1,41 v168.4,41.7 | v162.6,73.4 159.1,73.4 159,73.5 PAD36.1
UNUSED_A7  (via drill 0.61)
  Top 0.254: v182.2,8.2 182.3,8.2 182.7,8.6 183.4,8.6 R57.1 | v152.8,15.5 153.1,15.8 153.1,28.4 v152.8,28.7 | v144.2,29.7 143.9,30 143.9,64.7 v144.2,65 | v142.3,68.4 142.3,73.2 v142.5,73.4
  Bottom 0.254: v182.2,8.2 176.7,8.2 176.4,8.5 168.7,8.5 161.7,15.5 v152.8,15.5 | v152.8,28.7 152.5,29 150.1,29 149.5,29.6 146.9,29.6 146.8,29.7 v144.2,29.7 | v144.2,65 142.3,66.9 v142.3,68.4 | v142.5,73.4 143.9,73.4 144,73.5 PAD28.1
UNUSED_A8  (via drill 0.61)
  Top 0.254: v177,9.1 177.2,8.9 177.4,8.9 177.5,8.8 178.2,8.8 R59.1 | v161.2,16.8 161.2,19.2 160.9,19.5 160.9,29.5 160.6,29.8 160.6,31.8 v160.9,32.1 | v151.6,41.4 151.6,44.8 151,45.4 151,61.7 148.9,63.8 148.9,69.6 149.2,69.9 149.2,76.1 v149.5,76.4
  Bottom 0.254: v177,9.1 168.9,9.1 v161.2,16.8 | v160.9,32.1 v151.6,41.4 | v149.5,76.4 146.1,76.4 146,76.5 PAD27.1
UNUSED_A9  (via drill 0.61)
  Top 0.254: v212.8,33 212.8,31.8 R63.1 | v174.7,41.8 174.4,42.1 174.4,64.6 173.6,65.4 173.6,69.7 173.8,69.9 173.8,78.6 173.1,79.3 173.1,81.5 v172.2,82.4
  Bottom 0.254: v212.8,33 206.2,39.6 180.7,39.6 178.5,41.8 v174.7,41.8 | v172.2,82.4 170.6,82.4 170.5,82.5 PAD40.1
UNUSED_GP1  (via drill 0.61)
  Top 0.254: v76,10 76,9.7 76.2,9.5 76.2,8.8 R20.1 | v96.6,11.9 v96.6,39.5 | v111.3,41.3 111.4,41.4 111.4,42.5 112,43.1 112,70.1 v111.7,70.4
  Bottom 0.254: v76,10 78.2,12.2 96.3,12.2 v96.6,11.9 | v96.6,39.5 96.6,39.9 98.3,41.6 111,41.6 v111.3,41.3 | v111.7,70.4 115.9,70.4 116,70.5 PAD2.1
UNUSED_GP2  (via drill 0.61)
  Top 0.254: v69.9,10.1 70,10 70,8.8 R22.1 | v73.6,11.9 v73.6,13.7 | v95.7,13.7 96,14 96,38.3 v95.7,38.6 | v110.1,40.7 110.4,41 110.4,41.6 110.8,42 110.8,42.7 111.4,43.3 111.4,67.1 v111.1,67.4
  Bottom 0.254: v69.9,10.1 71.7,11.9 v73.6,11.9 | v73.6,13.7 73.9,13.4 95.4,13.4 v95.7,13.7 | v95.7,38.6 96.9,38.6 99.3,41 109.8,41 v110.1,40.7 | v111.1,67.4 115.9,67.4 116,67.5 PAD1.1
UNUSED_GP3  (via drill 0.61)
  Top 0.254: v169.2,10 169.5,9.7 169.5,8.8 R53.1 | v160.3,18.9 160.3,29.3 160,29.6 160,43 160.3,43.3 v160.3,44.5 | v150.7,44.5 150.4,44.8 150.4,61.5 148.3,63.6 148.3,69.8 148.6,70.1 148.6,78.5 v147.7,79.4
  Bottom 0.254: v169.2,10 v160.3,18.9 | v160.3,44.5 v150.7,44.5 | v147.7,79.4 146.1,79.4 146,79.5 PAD26.1
UNUSED_GP4  (via drill 0.61)
  Top 0.254: v163.3,10.1 R55.1 | v155.2,14.5 154.9,14.8 154.9,27.2 v155.2,27.5 | v148.5,28.7 147.3,29.9 147.3,43.9 v147.4,44 | v151.9,45.7 151.6,46 151.6,61.9 149.5,64 149.5,69.4 149.8,69.7 149.8,75.5 150.4,76.1 150.4,76.7 149.2,77.9 149.2,78.7 148.6,79.3 148.6,81.5 v147.7,82.4
  Bottom 0.254: v163.3,10.1 158.9,14.5 v155.2,14.5 | v155.2,27.5 154.9,27.8 152.5,27.8 151.9,28.4 149.9,28.4 149.6,28.7 v148.5,28.7 | v147.4,44 147.7,44.3 147.9,44.3 149.3,45.7 v151.9,45.7 | v147.7,82.4 146.1,82.4 146,82.5 PAD25.1
UNUSED_GP6  (via drill 0.61)
  Top 0.254: v209.9,10 210.1,9.8 210.1,8.8 R75.1 | v198.1,15.6 197.8,15.9 197.8,40.2 v198.1,40.5 | v176.8,43.3 176.8,44.5 176.2,45.1 176.2,65.2 175.4,66 175.4,69.1 175.6,69.3 175.6,73.1 v175.9,73.4
  Bottom 0.254: v209.9,10 204.6,15.3 198.4,15.3 v198.1,15.6 | v198.1,40.5 197.8,40.2 180.9,40.2 178.7,42.4 177.7,42.4 v176.8,43.3 | v175.9,73.4 170.6,73.4 170.5,73.5 PAD37.1

### Text on the board
tPlace: 12V POWER OUT | MCN1 | MCN2 | MCN3 | RCTL | CAN | GND | 12V | CAN A | CAN A | CAN 2 | CAN 2 | Kvaser | OUT | CAN Mirror | OUT | 12V POWER IN | GPS | MCN1 | MCN1 | MCN2 | MCN3 | RCTL